# EAGLE board EEZ DIB MCU r1B1 (EAGLE 9.1.0), part 1 of 2
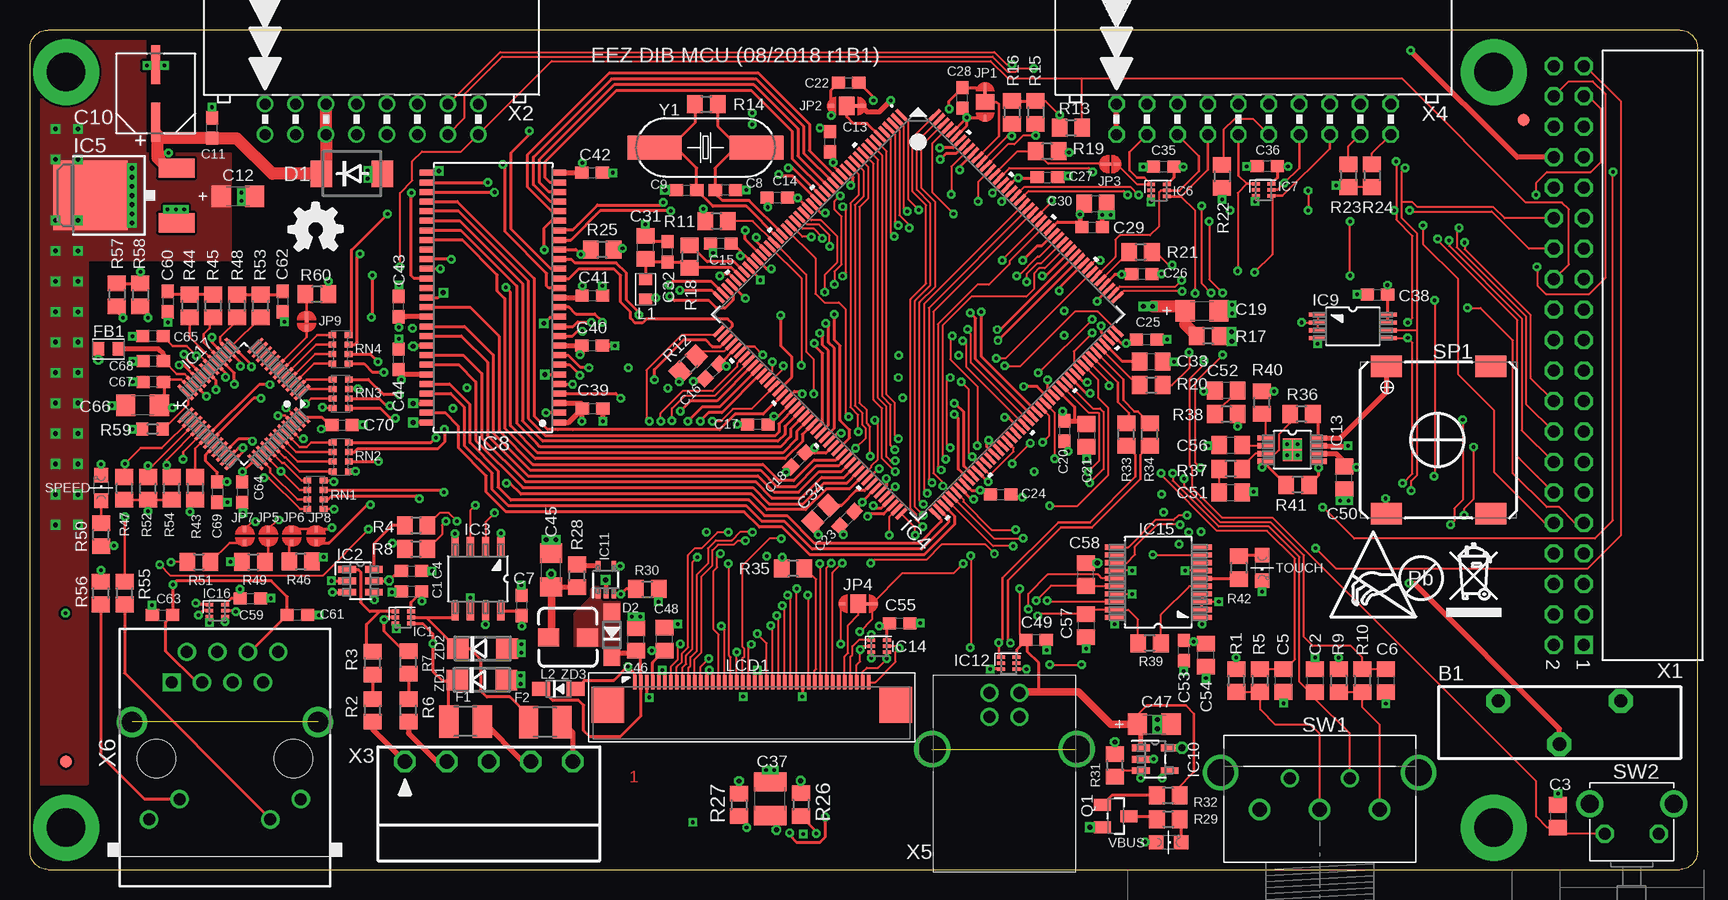
[diagram p5: board, top side]
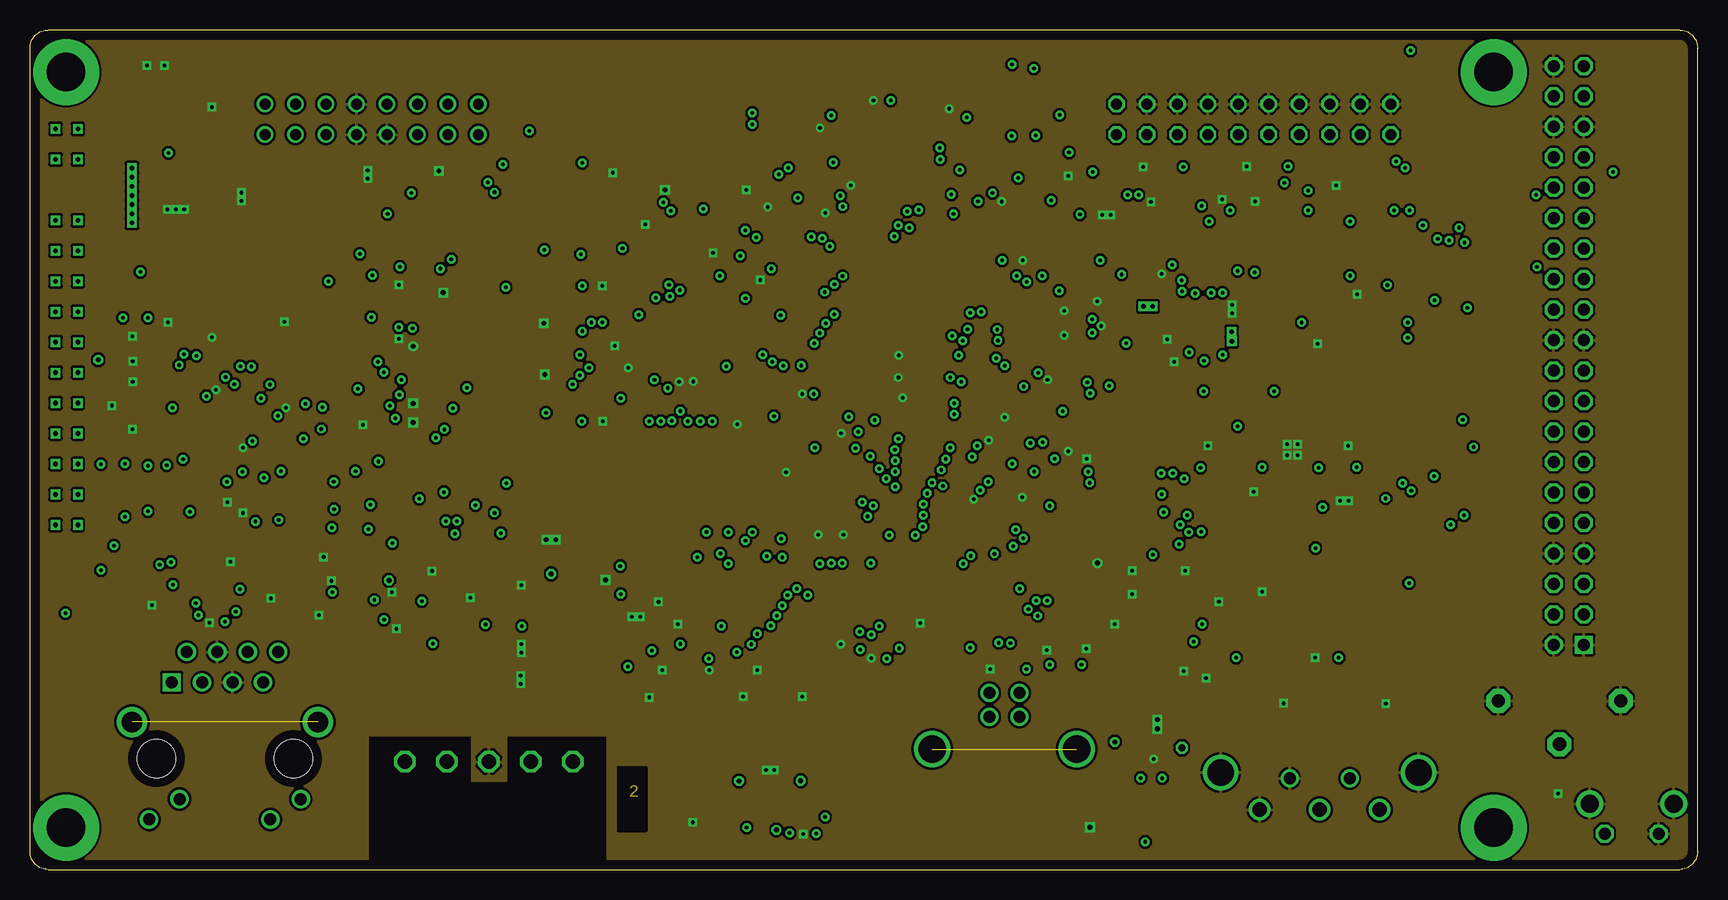
[diagram p6: board, inner layer Gnd]
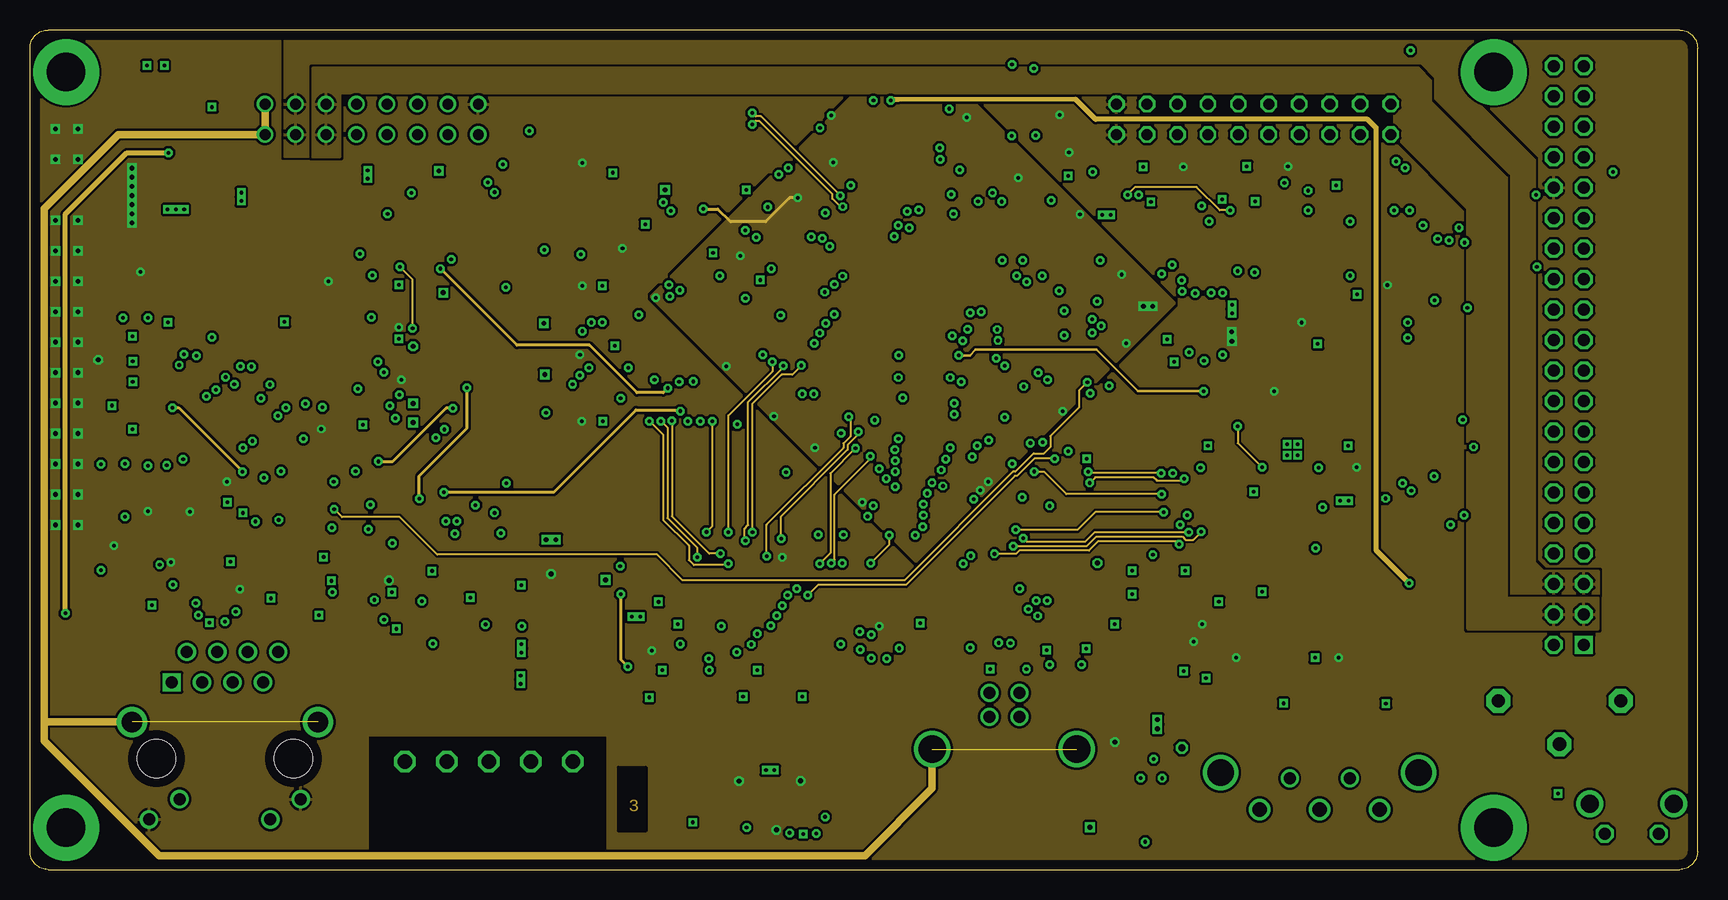
[diagram p7: board, inner layer Power]
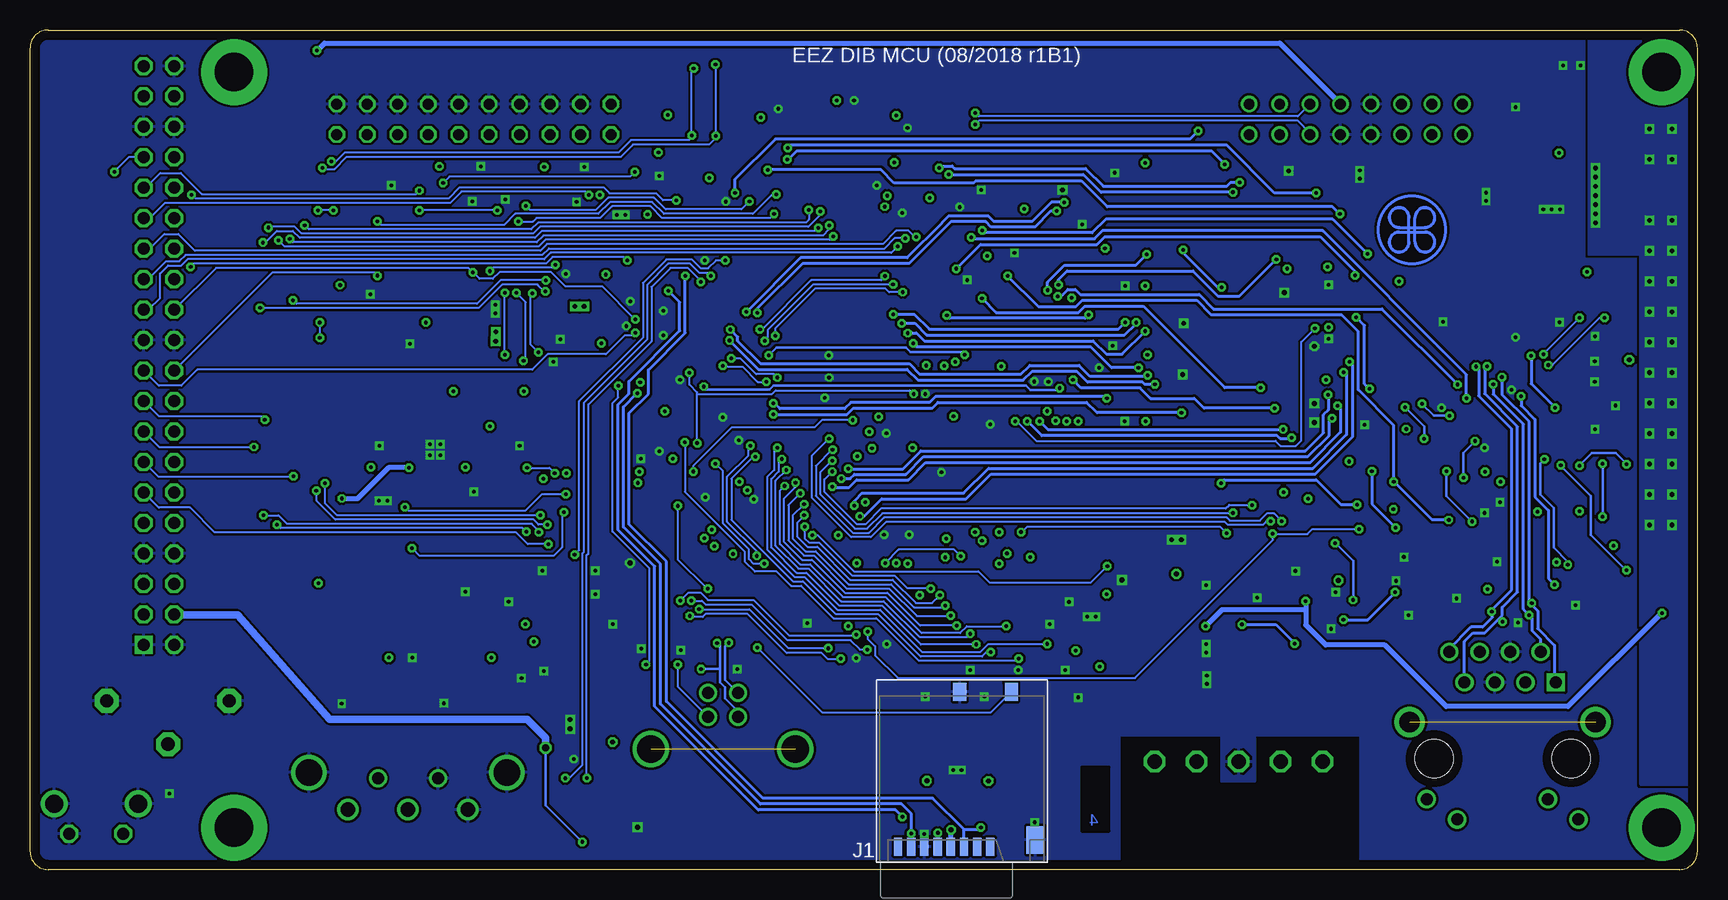
[diagram p8: board, bottom side, seen from below]

Size 139 x 70 mm. Coordinates in mm from the lower left corner, seen from the top.
Outline: 1.5,0 137.5,0 arc90 139,1.5 139,68.5 arc90 137.5,70 1.5,70 arc90 0,68.5 0,1.5 arc90 1.5,0
Copper layers (1+2+15+16): Top 0.035559375mm / dielectric 7mil / Gnd 0.03048125mm / dielectric 44mil / Power 0.03048125mm / dielectric 7mil / Bottom 0.035559375mm
Design rules "default *": minimum track width 6mil, minimum drill 0.3mm, track to track 4mil, track to pad 4mil, pad to pad 4mil, via to via 4mil, smd to smd 4mil, copper to edge 30mil, drill to drill 8mil, minimum pad ring 4mil, minimum via ring 8mil, stop-mask expansion 2.5mil, vias tented up to drill 0.6mm, thermal gap 8mil
Net classes: 0 default: width 0.152 mm, drill 0.3 mm, clearance 0.203 mm; 1 diff: width 0.229 mm, drill 0.3 mm, clearance 0.203 mm; 2 gnd: width 0.152 mm, drill 0.3 mm, clearance 0.203 mm

## Footprints (pad centres in the part's own frame; a part is rotated, then mirrored left to right if it is on the bottom)
DS1092-16-B6P = drill 1.1 pad 2 octagon: 1 -5.1,1.8; 2 0,-1.8; 3 5.1,1.8
C0603 = smd 1.1 x 1: 1 -0.85,0; 2 0.85,0
C0805 = smd 1.3 x 1.5: 1 -0.95,0; 2 0.95,0
CAPAE660X610N = smd 3.251 x 0.762: 1 -2.413,0; 2 2.413,0
EC1206 = smd 1.6 x 1.8: + -1.4,0; - 1.4,0
C1210 = smd 1.6 x 2.7: 1 -1.4,0; 2 1.4,0
C1206 = smd 1.6 x 1.8: 1 -1.4,0; 2 1.4,0
DO214AA = smd 1.8 x 2.2: A 2.55,0; C -2.55,0
SOD123 = smd 1.4 x 1.4: A 1.9,0; C -1.9,0
F1210 = smd 1.6 x 2.7: 1 -1.4,0; 2 1.4,0
BEAD0603 = smd 1 x 1.1: P$1 -0.85,0; P$2 0.85,0
FIDUCIAL = smd 1.016 x 1.016: T 0,0
DRL6 = smd 0.654 x 0.301: 1 -0.65,0.5; 2 -0.65,0; 3 -0.65,-0.5; 4 0.65,-0.5; 5 0.65,0; 6 0.65,0.5
DBV6 = smd 1.473 x 0.559: 1 -1.118,0.95; 2 -1.118,0; 3 -1.118,-0.95; 4 1.118,-0.95; 5 1.118,0; 6 1.118,0.95
SOIC127P600X173-8N = smd 1.55 x 0.6: 1 -2.7,1.9; 2 -2.7,0.63; 3 -2.7,-0.64; 4 -2.7,-1.91; 5 2.7,-1.91; 6 2.7,-0.64; 7 2.7,0.63; 8 2.7,1.9
LQFP-176_24X24MM = smd 1.2 x 0.3: 1 -12.75,10.75; 2 -12.75,10.25; 3 -12.75,9.75; 4 -12.75,9.25; 5 -12.75,8.75; 6 -12.75,8.25; 7 -12.75,7.75; 8 -12.75,7.25; 9 -12.75,6.75; 10 -12.75,6.25; 11 -12.75,5.75; 12 -12.75,5.25; 13 -12.75,4.75; 14 -12.75,4.25; 15 -12.75,3.75; 16 -12.75,3.25; 17 -12.75,2.75; 18 -12.75,2.25; 19 -12.75,1.75; 20 -12.75,1.25; 21 -12.75,0.75; 22 -12.75,0.25; 23 -12.75,-0.25; 24 -12.75,-0.75; 25 -12.75,-1.25; 26 -12.75,-1.75; 27 -12.75,-2.25; 28 -12.75,-2.75; 29 -12.75,-3.25; 30 -12.75,-3.75; 31 -12.75,-4.25; 32 -12.75,-4.75; 33 -12.75,-5.25; 34 -12.75,-5.75; 35 -12.75,-6.25; 36 -12.75,-6.75; 37 -12.75,-7.25; 38 -12.75,-7.75; 39 -12.75,-8.25; 40 -12.75,-8.75; 41 -12.75,-9.25; 42 -12.75,-9.75; 43 -12.75,-10.25; 44 -12.75,-10.75; 89 12.75,-10.75; 90 12.75,-10.25; 91 12.75,-9.75; 92 12.75,-9.25; 93 12.75,-8.75; 94 12.75,-8.25; 95 12.75,-7.75; 96 12.75,-7.25; 97 12.75,-6.75; 98 12.75,-6.25; 99 12.75,-5.75; 100 12.75,-5.25; 101 12.75,-4.75; 102 12.75,-4.25; 103 12.75,-3.75; 104 12.75,-3.25; 105 12.75,-2.75; 106 12.75,-2.25; 107 12.75,-1.75; 108 12.75,-1.25; 109 12.75,-0.75; 110 12.75,-0.25; 111 12.75,0.25; 112 12.75,0.75; 113 12.75,1.25; 114 12.75,1.75; 115 12.75,2.25; 116 12.75,2.75; 117 12.75,3.25; 118 12.75,3.75; 119 12.75,4.25; 120 12.75,4.75; 121 12.75,5.25; 122 12.75,5.75; 123 12.75,6.25; 124 12.75,6.75; 125 12.75,7.25; 126 12.75,7.75; 127 12.75,8.25; 128 12.75,8.75; 129 12.75,9.25; 130 12.75,9.75; 131 12.75,10.25; 132 12.75,10.75 | smd 0.3 x 1.2: 45 -10.75,-12.75; 46 -10.25,-12.75; 47 -9.75,-12.75; 48 -9.25,-12.75; 49 -8.75,-12.75; 50 -8.25,-12.75; 51 -7.75,-12.75; 52 -7.25,-12.75; 53 -6.75,-12.75; 54 -6.25,-12.75; 55 -5.75,-12.75; 56 -5.25,-12.75; 57 -4.75,-12.75; 58 -4.25,-12.75; 59 -3.75,-12.75; 60 -3.25,-12.75; 61 -2.75,-12.75; 62 -2.25,-12.75; 63 -1.75,-12.75; 64 -1.25,-12.75; 65 -0.75,-12.75; 66 -0.25,-12.75; 67 0.25,-12.75; 68 0.75,-12.75; 69 1.25,-12.75; 70 1.75,-12.75; 71 2.25,-12.75; 72 2.75,-12.75; 73 3.25,-12.75; 74 3.75,-12.75; 75 4.25,-12.75; 76 4.75,-12.75; 77 5.25,-12.75; 78 5.75,-12.75; 79 6.25,-12.75; 80 6.75,-12.75; 81 7.25,-12.75; 82 7.75,-12.75; 83 8.25,-12.75; 84 8.75,-12.75; 85 9.25,-12.75; 86 9.75,-12.75; 87 10.25,-12.75; 88 10.75,-12.75; 133 10.75,12.75; 134 10.25,12.75; 135 9.75,12.75; 136 9.25,12.75; 137 8.75,12.75; 138 8.25,12.75; 139 7.75,12.75; 140 7.25,12.75; 141 6.75,12.75; 142 6.25,12.75; 143 5.75,12.75; 144 5.25,12.75; 145 4.75,12.75; 146 4.25,12.75; 147 3.75,12.75; 148 3.25,12.75; 149 2.75,12.75; 150 2.25,12.75; 151 1.75,12.75; 152 1.25,12.75; 153 0.75,12.75; 154 0.25,12.75; 155 -0.25,12.75; 156 -0.75,12.75; 157 -1.25,12.75; 158 -1.75,12.75; 159 -2.25,12.75; 160 -2.75,12.75; 161 -3.25,12.75; 162 -3.75,12.75; 163 -4.25,12.75; 164 -4.75,12.75; 165 -5.25,12.75; 166 -5.75,12.75; 167 -6.25,12.75; 168 -6.75,12.75; 169 -7.25,12.75; 170 -7.75,12.75; 171 -8.25,12.75; 172 -8.75,12.75; 173 -9.25,12.75; 174 -9.75,12.75; 175 -10.25,12.75; 176 -10.75,12.75
DPACK = smd 1.6 x 3: 1 -2.28,-4.8; 3 2.28,-4.8 | smd 5.8 x 6.2: 4 0,2.38
TSOPII-54 = smd 1.2 x 0.5: 1 -5.502,10.4; 2 -5.502,9.6; 3 -5.502,8.8; 4 -5.502,8; 5 -5.502,7.2; 6 -5.502,6.4; 7 -5.502,5.6; 8 -5.502,4.8; 9 -5.502,4; 10 -5.502,3.2; 11 -5.502,2.4; 12 -5.502,1.6; 13 -5.502,0.8; 14 -5.502,0; 15 -5.502,-0.8; 16 -5.502,-1.6; 17 -5.502,-2.4; 18 -5.502,-3.2; 19 -5.502,-4; 20 -5.502,-4.8; 21 -5.502,-5.6; 22 -5.502,-6.4; 23 -5.502,-7.2; 24 -5.502,-8; 25 -5.502,-8.8; 26 -5.502,-9.6; 27 -5.502,-10.4; 28 5.502,-10.4; 29 5.502,-9.6; 30 5.502,-8.8; 31 5.502,-8; 32 5.502,-7.2; 33 5.502,-6.4; 34 5.502,-5.6; 35 5.502,-4.8; 36 5.502,-4; 37 5.502,-3.2; 38 5.502,-2.4; 39 5.502,-1.6; 40 5.502,-0.8; 41 5.502,0; 42 5.502,0.8; 43 5.502,1.6; 44 5.502,2.4; 45 5.502,3.2; 46 5.502,4; 47 5.502,4.8; 48 5.502,5.6; 49 5.502,6.4; 50 5.502,7.2; 51 5.502,8; 52 5.502,8.8; 53 5.502,9.6; 54 5.502,10.4
PW8_TSSOP8 = smd 1.473 x 0.356: 1 -2.921,0.975; 2 -2.921,0.325; 3 -2.921,-0.325; 4 -2.921,-0.975; 5 2.921,-0.975; 6 2.921,-0.325; 7 2.921,0.325; 8 2.921,0.975
DBV5 = smd 1.473 x 0.559: 1 -1.194,0.95; 2 -1.194,0; 3 -1.194,-0.95; 4 1.194,-0.95; 5 1.194,0.95
DCK5 = smd 0.85 x 0.4: 1 -1.125,0.65; 2 -1.125,0; 3 -1.125,-0.65; 4 1.125,-0.65; 5 1.125,0.65
SOP65P490X110-9N = smd 1.422 x 0.432: 1 -2.184,0.965; 2 -2.184,0.33; 3 -2.184,-0.33; 4 -2.184,-0.965; 5 2.184,-0.965; 6 2.184,-0.33; 7 2.184,0.33; 8 2.184,0.965 | smd 1.575 x 1.88: TP 0,0
SOP65P780X200-20N = smd 1.651 x 0.432: 1 -3.632,2.921; 2 -3.632,2.286; 3 -3.632,1.626; 4 -3.632,0.965; 5 -3.632,0.33; 6 -3.632,-0.33; 7 -3.632,-0.965; 8 -3.632,-1.626; 9 -3.632,-2.286; 10 -3.632,-2.921; 11 3.632,-2.921; 12 3.632,-2.286; 13 3.632,-1.626; 14 3.632,-0.965; 15 3.632,-0.33; 16 3.632,0.33; 17 3.632,0.965; 18 3.632,1.626; 19 3.632,2.286; 20 3.632,2.921
PT48 = smd 1.676 x 0.279: 1 -4.115,2.75; 2 -4.115,2.25; 3 -4.115,1.75; 4 -4.115,1.25; 5 -4.115,0.75; 6 -4.115,0.25; 7 -4.115,-0.25; 8 -4.115,-0.75; 9 -4.115,-1.25; 10 -4.115,-1.75; 11 -4.115,-2.25; 12 -4.115,-2.75; 25 4.115,-2.75; 26 4.115,-2.25; 27 4.115,-1.75; 28 4.115,-1.25; 29 4.115,-0.75; 30 4.115,-0.25; 31 4.115,0.25; 32 4.115,0.75; 33 4.115,1.25; 34 4.115,1.75; 35 4.115,2.25; 36 4.115,2.75 | smd 0.279 x 1.676: 13 -2.75,-4.115; 14 -2.25,-4.115; 15 -1.75,-4.115; 16 -1.25,-4.115; 17 -0.75,-4.115; 18 -0.25,-4.115; 19 0.25,-4.115; 20 0.75,-4.115; 21 1.25,-4.115; 22 1.75,-4.115; 23 2.25,-4.115; 24 2.75,-4.115; 37 2.75,4.115; 38 2.25,4.115; 39 1.75,4.115; 40 1.25,4.115; 41 0.75,4.115; 42 0.25,4.115; 43 -0.25,4.115; 44 -0.75,4.115; 45 -1.25,4.115; 46 -1.75,4.115; 47 -2.25,4.115; 48 -2.75,4.115
5033981892 = smd 0.7 x 1.5: 1 4.45,12.6; 2 5.55,12.6; 3 6.65,12.6; 4 7.75,12.6; 5 8.85,12.6; 6 9.95,12.6; 7 11.05,12.6; 8 12.15,12.6 | smd 1.45 x 2.33: S 0.7,12.04 | smd 1.1 x 1.5: SW1 2.7,-0.3; SW2 7,-0.3
JP3-CUT = smd 1.27 x 1.524: COM 0,0 | smd 0.889 x 0.254: NC -1.143,0 | smd 0.508 x 0.254: NO 1.333,0
JP2-NOCUT = smd 0.889 x 0.254: 1 -0.381,0 | smd 0.508 x 0.254: 2 0.572,0
JP2-CUT = smd 0.508 x 0.254: 1 -0.572,0; 2 0.572,0
DE0403 = smd 1.5 x 1.75: 1 0,1.626; 2 0,-1.625
FPC_40 = smd 0.3 x 1.2: 1 -9.75,1.9; 2 -9.25,1.9; 3 -8.75,1.9; 4 -8.25,1.9; 5 -7.75,1.9; 6 -7.25,1.9; 7 -6.75,1.9; 8 -6.25,1.9; 9 -5.75,1.9; 10 -5.25,1.9; 11 -4.75,1.9; 12 -4.25,1.9; 13 -3.75,1.9; 14 -3.25,1.9; 15 -2.75,1.9; 16 -2.25,1.9; 17 -1.75,1.9; 18 -1.25,1.9; 19 -0.75,1.9; 20 -0.25,1.9; 21 0.25,1.9; 22 0.75,1.9; 23 1.25,1.9; 24 1.75,1.9; 25 2.25,1.9; 26 2.75,1.9; 27 3.25,1.9; 28 3.75,1.9; 29 4.25,1.9; 30 4.75,1.9; 31 5.25,1.9; 32 5.75,1.9; 33 6.25,1.9; 34 6.75,1.9; 35 7.25,1.9; 36 7.75,1.9; 37 8.25,1.9; 38 8.75,1.9; 39 9.25,1.9; 40 9.75,1.9 | smd 2.7 x 3: Z1 -12,0; Z2 12,0
SOT23-BEC = smd 1 x 1.4: B -0.95,-1.1; C 0,1.1; E 0.95,-1.1
R0805 = smd 1.3 x 1.5: 1 -0.95,0; 2 0.95,0
R0603 = smd 1 x 1.1: 1 -0.85,0; 2 0.85,0
CAY16 = smd 0.5 x 0.65: 1 -1.2,-0.675; 2 -0.4,-0.675; 3 0.4,-0.675; 4 1.2,-0.675; 5 1.2,0.675; 6 0.4,0.675; 7 -0.4,0.675; 8 -1.2,0.675
LD-BZEL-M1313 = smd 1.8 x 2.6: + -6.15,-4.35; - 6.15,-4.35; NC1 -6.15,4.35; NC2 6.15,4.35
LED_0805 = smd 1.2 x 1.2: A 0,-1.05; C 0,1.05
PEC16-2215F = drill 1.2: A 0,5; B 0,0; C 0,-5 | drill 1: D -2.6,-2.5; E -2.6,2.5 | drill 2.2: GND1 -3.1,8.25; GND2 -3.1,-8.25
BSF-315X = drill 1 octagon: 1 -2.25,0; 2 2.25,0 | drill 1.5: 3 -3.5,2.5; 4 3.5,2.5
ZL263-40DG = drill 1 pad 1.5 square: 1 48.26,2.54 | drill 1 pad 1.5 octagon: 2 48.26,0; 3 45.72,2.54; 4 45.72,0; 5 43.18,2.54; 6 43.18,0; 7 40.64,2.54; 8 40.64,0; 9 38.1,2.54; 10 38.1,0; 11 35.56,2.54; 12 35.56,0; 13 33.02,2.54; 14 33.02,0; 15 30.48,2.54; 16 30.48,0; 17 27.94,2.54; 18 27.94,0; 19 25.4,2.54; 20 25.4,0; 21 22.86,2.54; 22 22.86,0; 23 20.32,2.54; 24 20.32,0; 25 17.78,2.54; 26 17.78,0; 27 15.24,2.54; 28 15.24,0; 29 12.7,2.54; 30 12.7,0; 31 10.16,2.54; 32 10.16,0; 33 7.62,2.54; 34 7.62,0; 35 5.08,2.54; 36 5.08,0; 37 2.54,2.54; 38 2.54,0; 39 0,2.54; 40 0,0
ML16L = drill 0.914: 1 -8.89,-1.27; 2 -8.89,1.27; 3 -6.35,-1.27; 4 -6.35,1.27; 5 -3.81,-1.27; 6 -3.81,1.27; 7 -1.27,-1.27; 8 -1.27,1.27; 9 1.27,-1.27; 10 1.27,1.27; 11 3.81,-1.27; 12 3.81,1.27; 13 6.35,-1.27; 14 6.35,1.27; 15 8.89,-1.27; 16 8.89,1.27
MC1,5/5-G-3,5 = drill 1.2 octagon: 1 -7,0; 2 -3.5,0; 3 0,0; 4 3.5,0; 5 7,0
ML20L = drill 0.914 octagon: 1 -11.43,-1.27; 2 -11.43,1.27; 3 -8.89,-1.27; 4 -8.89,1.27; 5 -6.35,-1.27; 6 -6.35,1.27; 7 -3.81,-1.27; 8 -3.81,1.27; 9 -1.27,-1.27; 10 -1.27,1.27; 11 1.27,-1.27; 12 1.27,1.27; 13 3.81,-1.27; 14 3.81,1.27; 15 6.35,-1.27; 16 6.35,1.27; 17 8.89,-1.27; 18 8.89,1.27; 19 11.43,-1.27; 20 11.43,1.27
USB-B = drill 1: 1 6.742,-1.377; 2 6.742,1.123; 3 4.742,1.123; 4 4.742,-1.377 | drill 2.3: M1 2.032,5.893; M2 2.032,-6.147
RJ45-TRAFO-LED = drill 1 pad 1.524 square: 1 -4.445,6.35 | drill 1 pad 1.524: 2 -3.175,8.89; 3 -1.905,6.35; 4 -0.635,8.89; 5 0.635,6.35; 6 1.905,8.89; 7 3.175,6.35; 8 4.445,8.89; 9 -6.325,-5.08; 10 -3.785,-3.38; 11 3.785,-5.08; 12 6.325,-3.38 | drill 1.7 pad 2.54: SH -7.75,3.05; SH2 7.75,3.05 | hole 3.2: -5.715,0; 5.715,0
HC-49/4H = smd 4.5 x 2: 1 -4.25,0; 2 4.25,0
DO214AC = smd 1.8 x 1.7: A 2.05,0; C -2.05,0
SOD323-W = smd 1.5 x 1.2: A 1.45,0; C -1.45,0

## Placement (x,y rotation side)
B1  DS1092-16-B6P  [DS1092-16-B6P]  127.5,12.26 0 top
C1  100n  [C0603]  31.8,23.18 180 top
C2  10n  [C0805]  107.12,15.75 270 top
C3  10n  [C0805]  127.37,4.45 270 top
C4  100n  [C0603]  31.8,24.89 0 top
C5  10n  [C0805]  104.49,15.76 90 top
C6  10n  [C0805]  113.02,15.75 270 top
C7  100n  [C0603]  40.96,22.01 270 top
C8  18p  [C0603]  57.97,56.64 180 top
C9  18p  [C0603]  54.73,56.64 0 top
C10  47u  [CAPAE660X610N]  10.47,64.71 90 top
C11  100n  [C0603]  15.17,61.82 90 top
C12  10u  [EC1206]  17.33,56.13 0 top
C13  100n  [C0603]  66.7,60.68 90 top
C14  100n  [C0603]  62.28,56.01 180 top
C15  100n  [C0603]  57.59,52.2 180 top
C16  100n  [C0603]  56.86,41.54 225 top
C17  100n  [C0603]  60.66,37.11 180 top
C18  100n  [C0603]  64.05,34.15 225 top
C19  4u7  [EC1206]  97.69,46.58 0 top
C20  100n  [C0603]  86.22,36.56 270 top
C21  1u  [C0805]  88.07,36.2 270 top
C22  N.C.  [C0603]  68.24,65.6 0 top
C23  100n  [C0603]  68.1,29.26 225 top
C24  100n  [C0603]  80.92,31.27 0 top
C25  100n  [C0603]  93.08,44.2 0 top
C26  100n  [C0603]  92.68,49.66 0 top
C27  100n  [C0603]  84.81,57.71 0 top
C28  100n  [C0603]  77.72,64.34 90 top
C29  100n  [C0603]  88.55,53.54 0 top
C30  1u  [C0805]  88.82,55.51 0 top
C31  1u  [C0805]  51.31,51.88 90 top
C32  100n  [C0603]  53.14,51.5 90 top
C33  2u2  [C0805]  93.46,42.35 0 top
C34  2u2  [C0805]  65.92,29.68 225 top
C35  100n  [C0603]  94.49,58.59 180 top
C36  100n  [C0603]  103.14,58.64 180 top
C37  10u  [C1210]  61.7,5.91 90 top
C38  100n  [C0603]  112.32,47.92 0 top
C39  100n  [C0603]  46.89,38.44 0 top
C40  100n  [C0603]  46.85,43.69 0 top
C41  100n  [C0603]  46.87,47.84 0 top
C42  100n  [C0603]  46.85,58.1 0 top
C43  100n  [C0603]  30.74,46.94 90 top
C44  100n  [C0603]  30.74,42.55 90 top
C45  4u7  [C1206]  43.44,24.97 90 top
C46  1u  [C0805]  50.52,19.19 90 top
C47  4u7/16V (293D475X9016A2TE3)  [EC1206]  93.72,12.12 0 top
C48  2u2  [C0805]  52.9,19.2 90 top
C49  100n  [C0603]  83.86,19.13 180 top
C50  1u  [C0805]  109.54,32.65 90 top
C51  470n  [C0805]  100.08,31.45 0 top
C52  470n  [C0805]  99.72,39.93 180 top
C53  100n  [C0603]  96.18,18.26 90 top
C54  1u  [C0805]  98.02,17.88 90 top
C55  100n  [C0603]  72.5,20.54 180 top
C56  220n  [C0805]  100.08,35.38 0 top
C57  10n  [C0805]  88.02,20.33 270 top
C58  10n  [C0805]  88,24.6 90 top
C59  100n  [C0603]  18.38,22.61 0 top
C60  100n  [C0603]  11.48,47.36 270 top
C61  100n  [C0603]  22.29,21.21 180 top
C62  100n  [C0603]  21.06,47.36 270 top
C63  100n  [C0603]  11.05,21.21 0 top
C64  100n  [C0603]  17.71,31.46 270 top
C65  100n  [C0603]  10.25,44.46 180 top
C66  10u  [EC1206]  9.39,38.7 180 top
C67  100n  [C0603]  10.28,40.67 180 top
C68  100n  [C0603]  10.28,42.38 180 top
C69  100n  [C0603]  15.61,31.47 270 top
C70  100n  [C0603]  26.01,37.06 0 top
D1  SMBJ5.0A-TR  [DO214AA]  26.84,58.01 0 top
D2  NSR0240  [SOD123]  48.49,19.57 90 top
EEZ_SIGNATURE  SIGNATURESMALL  [SIGNATURE_5MM]  23.8,53.34 180 top
F1  50mA  [F1210]  36.31,12.34 180 top
F2  50mA  [F1210]  42.96,12.29 180 top
FB1  60R@100MHz  [BEAD0603]  6.53,43.41 0 top
FM1  FIDUCIAL  [FIDUCIAL]  3,9 0 top
FM2  FIDUCIAL  [FIDUCIAL]  124.5,62.5 0 top
IC1  TPD4E001DRLR  [DRL6]  31.11,21.02 0 top
IC2  SN74LVC2G34DBVR  [DBV6]  27.55,24.07 0 top
IC3  BTS3408G  [SOIC127P600X173-8N]  37.34,24.24 270 top
IC4  STM32F769IGT6  [LQFP-176_24X24MM]  74.03,46.29 315 top
IC5  LD1117ADT33TR  [DPACK]  7.42,56.2 90 top
IC6  TPD4E001DRLR  [DRL6]  94.11,56.62 0 top
IC7  TPD4E001DRLR  [DRL6]  102.82,56.67 0 top
IC8  IS42S16400J  [TSOPII-54]  38.6,47.69 180 top
IC9  BR24G64FVT-3AGE2  [PW8_TSSOP8]  110.27,45.29 0 top
IC10  TPS2051BDBVR  [DBV5]  93.79,9.19 0 top
IC11  TPS61169DCKR  [DCK5]  48.01,24.17 90 top
IC12  TPD4E001DRLR  [DRL6]  81.59,17.21 0 top
IC13  TPA6205A1DGN  [SOP65P490X110-9N]  105.22,35 0 top
IC14  TPD4E001DRLR  [DRL6]  70.78,18.63 0 top
IC15  AR1021-I/SS  [SOP65P780X200-20N]  94.05,23.95 180 top
IC16  TPD4E001DRLR  [DRL6]  15.61,21.59 0 top
IC17  DP83848CVV/NOPB  [PT48]  17.84,38.82 225 top
J1  5033981892  [5033981892]  54.5,14.5 180 bottom
JP1  JP3-CUT  [JP3-CUT]  79.62,64 270 top
JP2  JP3-CUT  [JP3-CUT]  68.09,63.67 180 top
JP3  JP2-NOCUT  [JP2-NOCUT]  90.05,58.81 0 top
JP4  JP3-CUT  [JP3-CUT]  69.04,22.16 180 top
JP5  JP2-CUT  [JP2-CUT]  19.87,27.81 270 top
JP6  JP2-CUT  [JP2-CUT]  21.82,27.81 270 top
JP7  JP2-CUT  [JP2-CUT]  17.91,27.81 90 top
JP8  JP2-CUT  [JP2-CUT]  23.84,27.81 270 top
JP9  JP2-NOCUT  [JP2-NOCUT]  23.05,45.69 270 top
L1  LCBA-600  [BEAD0603]  51.31,48.37 90 top
L2  DLG-0403-4R7  [DE0403]  44.84,19.37 90 top
LCD1  PCA-6-LA-40-HL-3  [FPC_40]  60.16,13.72 0 top
Q1  MMBT5551  [SOT23-BEC]  90.5,4.46 270 top
R1  4K7  [R0805]  100.55,15.76 270 top
R2  4K7  [R0805]  28.57,13.27 90 top
R3  4K7  [R0805]  28.57,17.21 90 top
R4  1K  [R0805]  32.19,28.7 0 top
R5  10K  [R0805]  102.52,15.76 270 top
R6  4K7  [R0805]  31.55,13.27 90 top
R7  4K7  [R0805]  31.55,17.27 90 top
R8  1K  [R0805]  32.19,26.73 0 top
R9  4K7  [R0805]  109.08,15.75 270 top
R10  10K  [R0805]  111.05,15.75 270 top
R11  10K  [R0805]  57.23,54.08 0 top
R12  10K  [R0805]  54.87,42.15 45 top
R13  4K7  [R0805]  86.77,61.86 0 top
R14  1M  [R0805]  56.38,63.82 0 top
R15  4K7  [R0805]  83.82,63.12 270 top
R16  4K7  [R0805]  81.86,63.12 270 top
R17  0R  [R0805]  98.2,44.49 180 top
R18  47R  [R0805]  55,51.1 270 top
R19  47K  [R0805]  84.79,59.88 180 top
R20  22R  [R0805]  93.46,40.39 0 top
R21  22R  [R0805]  92.57,51.5 0 top
R22  10K  [R0805]  99.37,57.78 270 top
R23  10K  [R0805]  109.9,57.85 270 top
R24  10K  [R0805]  111.87,57.85 270 top
R25  10K  [R0805]  47.69,51.69 180 top
R26  47K  [R0805]  64.27,5.41 270 top
R27  47K  [R0805]  59.1,5.4 270 top
R28  10R  [R0805]  45.61,24.49 90 top
R29  47K  [R0805]  94.89,4.2 0 top
R30  10R  [R0805]  51.45,23.38 0 top
R31  47K  [R0805]  90.43,8.69 90 top
R32  47K  [R0805]  94.89,6.17 180 top
R33  22R  [R0805]  91.38,36.27 90 top
R34  22R  [R0805]  93.34,36.27 90 top
R35  10K  [R0805]  63.61,25.11 180 top
R36  20K  [R0805]  105.99,37.99 180 top
R37  10K  [R0805]  100.08,33.41 180 top
R38  10K  [R0805]  99.72,37.96 180 top
R39  20K  [R0805]  93.32,18.87 180 top
R40  47K  [R0805]  102.68,38.94 90 top
R41  20K  [R0805]  105.67,32.08 180 top
R42  4K7  [R0805]  100.75,25.16 270 top
R43  1K5  [R0805]  13.77,31.78 270 top
R44  49R9  [R0805]  13.33,46.99 270 top
R45  49R9  [R0805]  15.28,46.99 90 top
R46  2K2  [R0805]  22.56,25.67 180 top
R47  2K2  [R0805]  7.87,31.78 90 top
R48  49R9  [R0805]  17.25,46.99 270 top
R49  2K2  [R0805]  18.62,25.65 0 top
R50  220R  [R0805]  5.92,27.91 90 top
R51  2K2  [R0805]  14.08,25.64 0 top
R52  2K2  [R0805]  9.83,31.78 90 top
R53  49R9  [R0805]  19.22,46.99 90 top
R54  2K2  [R0805]  11.8,31.78 90 top
R55  220R  [R0805]  7.89,23.05 90 top
R56  220R  [R0805]  5.91,23.05 90 top
R57  2K2  [R0805]  7.24,47.92 270 top
R58  2K2  [R0805]  9.2,47.92 270 top
R59  4K87  [R0603]  10.21,36.73 0 top
R60  2K2  [R0805]  23.92,47.97 180 top
RN1  DR1206-33R-4/8  [CAY16]  23.8,31.24 90 top
RN2  DR1206-33R-4/8  [CAY16]  25.91,34.4 90 top
RN3  DR1206-33R-4/8  [CAY16]  25.91,39.67 90 top
RN4  DR1206-33R-4/8  [CAY16]  25.89,43.38 90 top
SP1  LD-BZEL-M1313  [LD-BZEL-M1313]  117.42,35.8 270 top
SPEED  HSMY-C170  [LED_0805]  5.94,31.81 0 top
SW1  PEC16-2215F-S0024  [PEC16-2215F]  107.5,5 270 top
SW2  BSF-3152  [BSF-315X]  133.5,3 0 top
TOUCH  HSMY-C170  [LED_0805]  102.71,25.15 180 top
U$1  [RECYCLE_BIN1/8]  118.05,21.06 0 top
U$5  [PB_SMALL]  115.95,24.29 180 top
U$6  [ESD_SYMBOL]  108.41,21.06 0 top
VBUS  HSMG-C170  [LED_0805]  94.91,2.27 270 top
X1  ZL263-40DG  [ZL263-40DG]  127,67 270 top
X2  ZL231-16KG  [ML16L]  28.48,62.56 0 top
X3  1844249  [MC1,5/5-G-3,5]  38.25,9 0 top
X4  ZL231-20KG  [ML20L]  102,62.56 0 top
X5  292304-1  [USB-B]  81.1,8 90 top
X6  LMJTAB881243M-L  [RJ45-TRAFO-LED]  16.25,9.25 0 top
Y1  10MHz  [HC-49/4H]  56.32,60.2 0 top
ZD1  SMAJ18A  [DO214AC]  37.66,15.8 0 top
ZD2  SMAJ18A  [DO214AC]  37.72,18.4 0 top
ZD3  BZX384-B30.115  [SOD323-W]  44.05,15.06 0 top

## Tracks (layer width: path | path; a pad name or v marks a point on that pad's centre or on a via)
!AUDIO_SHDN
  Top 0.152: IC13.1 103.04,37.63 R40.1
!FAULT  (via drill 0.3)
  Top 0.152: IC4.58 60.13,38.41 58.6,38.41 57.59,37.39 v56.86,37.39 | 87.7,65.97 81.51,65.97 80.08,67.4 43.48,67.4 X2.15 35.95,59.87 32.68,59.87 31.87,59.05 31.87,57.44 30.84,56.41 v30.84,50.24 | 87.7,65.97 114.34,65.97 124.69,55.61 127.7,55.61 128.27,55.04 128.27,50.46 127.04,49.22 X1.26 | R13.2 87.7,61.88 87.7,65.97
  Top 0.254: v39.25,28.04 IC3.1
  Power 0.152: v56.86,37.39 56.86,28.61 v56.39,28.14 | v30.84,50.24 31.89,49.19 v31.89,45.12
  Bottom 0.152: v56.39,28.14 56.32,28.14 55.87,28.59 39.79,28.59 v39.25,28.04 | v56.86,37.39 56.76,37.39 55.11,35.74 35.18,35.74 34.76,35.32 33.48,35.32 33.04,35.76 33.04,43.98 v31.89,45.12
!RESET  (via drill 0.3)
  Top 0.152: R11.2 60.24,54.08 IC4.31 64.7,49.62 64.7,43.18 65.35,42.53 v65.35,39.65 | v28.22,28.38 28.22,28.35 24.38,24.5 11.74,24.5 v10.81,25.43 | v81.87,33.83 81.87,34.04 v83.39,35.56 | v88.55,45.87 84.1,41.43 v84.04,41.43 | IC7.4 103.56,56.08 103.56,51.28 v102.07,49.8 | v69.17,19.82 70.18,20.84 JP4.NC 72.75,24.73 77.02,24.73 v77.78,25.49 | IC3.4 35.44,27.98 v35.41,28
  Top 0.203: IC17.29 12.77,34.82 v12.77,34.2 | IC7.4 104.41,56.17 108.35,60.1 X4.15
  Top 0.254: IC3.4
  Bottom 0.152: v28.22,28.38 32.1,28.38 32.5,27.98 35.39,27.98 | v65.35,39.65 65.65,39.95 76.85,39.95 77.18,39.62 83.37,39.62 83.39,39.6 | v83.39,35.56 83.39,39.6 | 83.39,39.6 83.39,39.79 84.03,40.42 84.03,41.41 v84.04,41.43 | X1.24 123.5,50.16 102.44,50.16 v102.07,49.8 101.53,49.25 100.42,49.25 99.86,49.81 95.56,49.81 94.39,48.64 91.32,48.64 v88.55,45.87 | v69.17,19.82 69.17,19.21 68.56,18.61 68.56,17.87 66.67,15.98 46.89,15.98 35.39,27.48 35.39,27.98 | 35.39,27.98 v35.41,28 | v77.78,25.49 78.68,25.49 79.07,25.88 79.07,26.68 81.25,28.85 81.25,33.21 v81.87,33.83
  Bottom 0.203: v12.77,34.2 13.11,33.86 13.11,31.25 11.99,30.14 11.99,26.84 10.81,25.65 v10.81,25.43
!USB_OTG_FS_OC  (via drill 0.3)
  Top 0.152: v83.08,48.98 83.08,49.64 83.98,50.55 84.29,50.55 IC4.146 | v92.59,7.63 92.59,8.23 IC10.3 90.94,8.24 R31.1
  Bottom 0.152: v83.08,48.98 83.08,49.07 84.15,50.15 85.61,50.15 87.19,48.58 87.19,44.03 92.45,38.77 92.45,26.35 92.59,26.21 v92.59,7.63
+3V3  (via drill 0.3, 0.4)
  Top 0.152: R1.1 v100.55,17.67 | R9.1 v109.08,17.65 | C35.1 v96.14,58.59 | v104.86,58.64 C36.1 | R13.1 v85.82,62.92 84.67,64.07 R15.1 | R51.1 v11.74,25.64 | R40.2 v103.7,39.89 | v106.01,45.61 IC9.2 | IC9.1 IC9.2 | IC9.3 IC9.2 | 71.43,20.41 70.92,20.41 v70.81,20.3 | R35.2 62.66,25.97 v62.7,26.02 | C44.1 30.94,41.7 30.95,41.68 | R50.1 5.95,26.99
  Top 0.203: R47.1 R52.1 | R52.1 R54.1 | R52.1 v9.83,29.87 | 5.95,26.99 v6.99,26.99 | R58.1 v9.2,49.82 | v5.68,42.49 FB1.P$1 | v24.88,49.03 24.89,47.99 R60.1
  Top 0.229: R26.1 64.27,7.37 v64.24,7.39
  Top 0.254: R57.1 R58.1 | C35.1 95.34,57.7 IC6.6 | C36.1 103.99,57.69 IC7.6 | v49.4,51.78 R25.1 | IC14.6 71.43,20.32 C55.2 71.43,20.32 71.43,20.41 | IC9.7 IC9.8 113.19,47.52 C38.2 113.15,47.56 v113.15,48.73 | IC17.32 14.66,34.59 14.66,34.06 15.61,33.11 C69.1 v16.41,32.32 | v30.75,45.21 30.75,46.08 C43.1 | v17.51,23.38 17.51,22.54 C59.1 16.78,22.61 IC16.6 | v13.33,29.83 13.33,30.38 R43.2 | v24.27,36.73 24.83,36.73 C70.1 24.97,37.06 24.34,37.69 22.85,37.69 IC17.48 | IC2.5 29.89,24.07 v29.93,24.11 30.71,24.89 C4.1 | LCD1.4 51.91,17.26 C48.1 v51.85,18.25 | 45.87,47.69 C41.1 | R16.1 R15.1 | v97.69,20.47 97.69,21.02 IC15.1 | C54.2 97.86,19 v97.01,19 96.3,19 C53.2 | v86.61,59.78 85.84,59.78 R19.1 | v110.58,33.54 109.6,33.54 C50.2
  Top 0.406: IC8.3 45.98,38.89 C39.1 | v46.03,48.67 46.03,47.71 C41.1 | v45.85,42.93 46.01,42.95 C40.1 IC8.9 | v46.03,58.93 46.01,58.9 C42.1 45.99,58.09 IC8.27 | IC8.43 31.33,46.09 C43.1 | IC8.49 31.16,41.29 C44.1 | 30.95,41.68 v30.95,40.82 | v59.1,7.38 R27.1 | C37.1 62.22,3.98 v62.22,3.3 | X4.1 X4.2 | IC8.14 45.87,47.69 | v100.17,44.83 99.49,44.83 R17.1 | v46.02,37.38 46.02,38.42 C39.1 | IC8.1 44.89,37.29 C39.1 | v90.43,10.63 R31.2 | IC13.6 108.86,34.67 109.54,33.98 C50.2 | R28.1 43.47,23.54 C45.1 v43.44,24.65
  Top 0.61: 43.47,23.54 43.47,19.63 L2.1
  Bottom 0.406: J1.4 62.25,3.27 v62.22,3.3
  other vias: 100.18,44.04 8.5,56.2 8.5,56.96 8.5,57.72 8.5,55.44 8.5,54.67 8.5,53.91 8.5,58.48 2.13,51.59 2.13,49.05 2.13,46.51 2.13,43.97 2.13,41.43 2.13,38.89 3.99,51.59 3.99,49.05 3.99,46.51 3.99,43.97 3.99,41.43 3.99,38.89 3.99,36.35 3.99,33.81 2.13,36.35 2.13,33.81 3.99,31.27 3.99,28.73 2.13,31.27 2.13,28.73 2.13,54.13 3.99,54.13 3.99,59.21 3.99,61.75 2.13,59.21 2.13,61.75
  pour Power (isolate 0.203, rank 4): -0.07,69.34 139.12,69.85 139.12,0.76 48.19,0.76 48.19,11.18 28.12,11.18 28.12,0.25 -0.07,0.25
  pour Top (isolate 0.203, no thermals): -0.33,70.1 9.58,70.1 9.58,59.69 16.69,59.69 16.69,50.8 4.75,50.8 4.75,7.11 -0.33,7.11
  pour Bottom (isolate 0.203, no thermals): -0.33,70.1 9.07,70.1 9.07,51.31 4.75,51.31 4.75,7.11 -0.33,7.11
+3V3(A)  (via drill 0.3)
  Top 0.203: IC17.22 12.88,41.3 12.25,41.3 11.17,42.38
  Top 0.254: 11.17,42.38 C68.1 | v14.7,39.47 14.7,39.49 IC17.22 | X6.3 13.93,15.6 11.33,18.2 11.33,20.64 C63.2 v11.9,23.76 12.22,24.08 20.11,24.08 21.44,22.75 C61.2 18.37,18.14 X6.6
  Top 0.406: C68.1 11.13,42.97 10.7,43.4 8.37,43.4 FB1.P$2
  Bottom 0.254: v14.7,39.47 14.7,38.68 13.55,37.54 13.55,31.08 12.43,29.95 12.43,24.28 v11.9,23.76
+5V  (via drill 0.3, 0.6)
  Top 0.152: C7.2 40.96,20.33 v41,20.3
  Top 0.254: C10.1 10.47,61.4 10.6,61.28 | IC1.6 31.76,22.28 C1.1 | IC3.8 40.58,21.54 C7.2 | VBUS.A 93.01,2.27 v92.97,2.31
  Top 0.406: C1.1 v32.66,22.39 | v11.55,59.77 11.29,59.77 10.75,59.22 | IC10.5 v96.01,10.14 v96.02,10.15
  Top 1.016: 10.6,61.28 10.62,61.25 10.62,61.23 | 10.62,61.23 10.62,59.35 10.75,59.22 11.48,58.48 IC5.3 | X2.6 X2.5 24.67,58.4 D1.C 20.21,58.01 17.25,60.97 C11.1 10.87,60.97 10.62,61.23
  Power 0.406: v2.95,21.37 2.95,54.65 8.07,59.77 v11.55,59.77
  Bottom 0.203: v96.02,10.15 96.02,5.36 v92.97,2.31
  Bottom 0.406: v2.95,21.37 3.01,21.37 10.8,13.59 20.95,13.59 26.08,18.72 30.98,18.72 32.66,20.39 32.66,21.67 | v32.66,22.39 32.66,21.67 | 32.66,21.67 32.67,21.65 39.64,21.65 v41,20.3
  Bottom 0.61: X1.4 126.91,21.21 121.7,21.21 114.04,12.54 97.57,12.54 96.02,10.99 v96.02,10.15
  pour Power (isolate 0.203): 23.55,59.44 25.84,59.44 25.84,64.77 113.72,64.77 113.72,61.21 119.82,55.12 119.82,20.07 130.74,20.07 130.74,22.61 123.12,22.61 123.12,57.66 116.77,64.01 116.77,65.79 115.75,66.8 23.55,66.8
+12V
  pour Power (isolate 0.203, rank 2): 23.55,59.44 21.26,59.44 21.26,70.1 120.83,70.1 120.83,63.75 125.4,59.18 125.4,25.65 126.17,24.89 130.74,24.89 130.74,22.61 123.12,22.61 123.12,57.66 116.77,64.01 116.77,65.79 115.5,67.06 23.55,67.06
+VAUX  (via drill 0.3)
  Top 0.406: X1.34 123.97,59.38 v115.08,68.28
  Bottom 0.406: X2.10 34.83,68.91 114.44,68.91 v115.08,68.28
BOOT0
  Top 0.203: JP1.COM 80.57,63.99 80.75,63.82 80.75,61.14 IC4.166
BYPASS_REG
  Top 0.152: IC4.48 57.85,43.19 55.91,43.19 R12.2
DAC_OUT1  (via drill 0.3)
  Top 0.152: v97.83,39.88 98.72,39.88 C52.2
  Top 0.203: IC4.50 59.67,43.6 60.39,43.6 v61.08,42.91
  Power 0.203: v77.42,42.86 78.34,42.86 78.82,43.34 88.89,43.34 92.35,39.89 v97.82,39.89 v97.83,39.88
  Bottom 0.203: v61.08,42.91 61.31,43.14 65.59,43.14 65.97,43.52 76.76,43.52 v77.42,42.86
DBGACK
  Top 0.152: R24.1 111.87,59.73 X4.19
DBGRQ
  Top 0.152: R23.1 109.9,60.3 X4.17
DIN1  (via drill 0.3)
  Top 0.152: v35.59,29.03 35.59,29.05 34.9,29.73 34.16,29.73 R4.2 | v72.39,35.93 v72.38,35.93 72.1,36.21 72.1,38.9 71.4,39.6 71.4,59.88 IC4.7
  Bottom 0.152: v35.59,29.03 35.96,29.03 36.25,28.74 39.15,28.74 39.4,28.99 67.64,28.99 68.91,27.72 70.55,27.72 73.84,31.01 73.84,34.48 v72.39,35.93
DIN2  (via drill 0.3)
  Top 0.152: v34.67,29.06 34.34,28.73 34.34,27.94 R8.2 | v72.1,35.01 71.75,35.37 71.75,38.75 71.05,39.45 71.05,59.53 IC4.8
  Bottom 0.152: v34.67,29.06 35.28,29.67 35.91,29.67 36.48,29.1 38.99,29.1 39.25,29.35 67.8,29.35 69.07,28.08 70.4,28.08 73.49,31.17 73.49,33.66 72.13,35.01 v72.1,35.01
DOUT1  (via drill 0.3)
  Top 0.152: v72.13,34.1 71.72,34.1 71.39,34.43 71.39,38.59 70.69,39.29 70.69,59.18 IC4.9 | v38.73,29.73 37.97,28.98 IC3.2
  Bottom 0.152: v38.73,29.73 38.75,29.7 67.95,29.7 69.22,28.43 70.25,28.43 73.13,31.32 73.13,33.1 v72.13,34.1
DOUT2  (via drill 0.3)
  Top 0.152: v72.11,33.19 71.03,34.27 71.03,38.44 70.32,39.15 70.32,58.84 IC4.10 | v37.14,30.39 36.7,29.95 IC3.3
  Bottom 0.152: v72.11,33.19 72.78,32.52 72.78,31.48 70.08,28.79 69.37,28.79 68.08,30.09 39.35,30.09 39.03,30.4 37.15,30.4 v37.14,30.39
ENC_A  (via drill 0.3)
  Top 0.152: R5.1 C5.2 104.61,16.71 105.44,17.54 105.44,25.92 103.11,28.25 98.94,28.25 94.3,32.88 v94.3,33.06 | IC4.119 88.25,38.09 89.04,38.09 89.11,38.02 89.11,34.07 v88.19,33.16
  Power 0.152: v94.3,33.06 88.3,33.06 v88.19,33.16
ENC_B  (via drill 0.3)
  Top 0.152: C6.1 R10.1 111.05,17.7 110.11,18.64 106.92,18.64 106.19,19.38 106.19,26.2 103.43,28.96 99.24,28.96 96.19,32 v96.19,32.59 | IC4.120 88.6,38.44 89.2,38.44 89.49,38.15 89.49,33.39 v88.33,32.23
  Power 0.152: v88.33,32.23 88.8,32.7 93.65,32.7 93.93,32.42 96.03,32.42 v96.19,32.59
ENC_SW  (via drill 0.3)
  Top 0.152: IC4.173 75.19,60.53 75.19,56.46 v76.98,54.67 | v99.43,48.07 98.3,49.2 v98.3,54.03 | v99.42,42.9 97.15,40.63 97.15,33.91 v97.57,33.49 | v95.27,33.06 95.27,32.42 99.09,28.6 103.28,28.6 105.82,26.06 105.82,15.63 106.66,14.8 C2.2 107.12,14.22 110,11.34 SW1.E
  Bottom 0.152: v76.98,54.67 v76.98,54.66 77.32,54.32 86.3,54.32 87.29,55.31 90.48,55.31 91.47,54.32 96.78,54.32 97.07,54.03 v98.3,54.03 | v97.57,33.49 95.7,33.49 v95.27,33.06 | v99.42,42.9 99.42,48.06 v99.43,48.07
EOUT_A
  Top 0.152: SW1.A 112.5,12.08 111.05,13.53 R10.2 R9.2
EOUT_B
  Top 0.152: R1.2 R5.2 102.54,14.79 102.54,13.34 103.81,12.06 106.73,12.06 107.5,11.3 SW1.B
ETH_COL  (via drill 0.3)
  Top 0.254: RN2.2 29.02,34 v29.04,34.02 | v52.06,40.84 52.06,41.69 54.54,44.17 56.32,44.17 56.86,43.62 57.58,43.62 IC4.47
  Power 0.254: v35.26,38.47 34.69,38.47 30.24,34.02 v29.04,34.02
  Bottom 0.254: v35.26,38.47 41.14,38.47 41.95,39.28 45.6,39.28 46.47,40.16 51.38,40.16 v52.06,40.84
ETH_CRS  (via drill 0.3)
  Top 0.203: v20.73,29.15 20.63,29.15 JP5.1
  Top 0.254: IC4.40 58.32,49.63 57.65,49.63 v57.51,49.49 | RN1.4 25.22,32.44 v25.32,32.35
  Bottom 0.254: v57.51,49.49 54.96,46.94 51.8,46.94 51.27,47.46 41.75,47.46 40.55,46.27 29.68,46.27 28.29,44.87 28.29,40.01 25.32,37.03 v25.32,32.35 22.11,29.15 v20.73,29.15
ETH_MDC  (via drill 0.3)
  Top 0.203: IC17.31 15.58,36.22
  Top 0.254: v19.26,39.29 18.66,39.29 15.58,36.22 | IC4.33 60.55,52.35 v60.55,52.69
  Bottom 0.254: v60.55,52.69 60.46,52.6 50.26,52.6 49.61,53.25 31.25,53.25 20.1,42.1 19.97,41.97 19.26,41.26 v19.26,39.29
ETH_MDIO  (via drill 0.3)
  Top 0.203: R43.1 13.77,35.11 IC17.30
  Top 0.254: IC4.42 58.6,47.93 58.6,47.48 57.94,46.83 57.92,46.83 57.9,46.81 57.22,46.81 56.61,47.42 53.71,47.42 v53.33,47.8 | v19.99,40.44 19.09,40.44 IC17.30
  Bottom 0.254: v19.99,40.44 26.31,46.75 40.34,46.75 41.53,47.94 51.45,47.94 51.87,48.36 52.48,48.36 53.04,47.8 v53.33,47.8
ETH_RX_CLK  (via drill 0.3)
  Top 0.254: IC4.41 59.6,47.64 v59.64,47.64 | RN1.2 24.85,30.84 25.16,31.15 32.22,31.15 v32.45,30.92
  Power 0.254: v36.4,40.18 36.4,36.78 32.45,32.83 v32.45,30.92
  Bottom 0.254: v59.64,47.64 58.46,46.46 51.59,46.46 51.07,46.98 46.21,46.98 39.41,40.18 v36.4,40.18
ETH_RX_DV  (via drill 0.3)
  Top 0.254: IC4.53 57.26,39.06 55.07,39.06 v54.22,38.23 | RN1.3 34.34,31.64 v34.51,31.47
  Power 0.254: v54.22,38.23 54.13,38.32 50.51,38.32 43.67,31.47 v34.51,31.47
ETH_RX_ER  (via drill 0.3)
  Top 0.203: JP8.1 JP6.1
  Top 0.254: RN2.1 v27.14,33.2 | JP8.1 25.05,28.38 v25.15,28.49
  Bottom 0.254: v27.14,33.2 27.14,30.48 v25.15,28.49
ETH_RXD0  (via drill 0.3)
  Top 0.254: RN2.3 27.02,34.8 27.32,35.1 34.02,35.1 34.55,35.64 v34.55,36.69 | IC4.54 57.48,38.58 56.04,38.58 v54.84,37.39
  Bottom 0.254: v34.55,36.69 34.57,36.66 54.12,36.66 v54.84,37.39
ETH_RXD1  (via drill 0.3)
  Top 0.254: RN2.4 33.42,35.6 v33.82,36.01 | IC4.55 60.92,41.34 57.67,38.1 56.57,38.1 v55.86,37.39
  Bottom 0.254: v55.86,37.39 54.65,36.18 35.04,36.18 34.8,35.94 33.89,35.94 v33.82,36.01
ETH_RXD2  (via drill 0.3)
  Top 0.254: RN3.1 29.18,38.48 30.03,37.63 30.46,37.63 v30.47,37.62 | IC4.83 71.43,32.02 71.43,32.54 v71.36,32.6
  Bottom 0.254: v30.47,37.62 30.7,37.39 30.7,36.21 32.49,34.42 64.52,34.42 65.98,32.96 70.29,32.96 70.64,32.6 v71.36,32.6
ETH_RXD3  (via drill 0.3)
  Top 0.254: RN3.2 29.09,39.27 29.7,38.67 v30,38.67 | IC4.84 72.03,31.91 v72.14,31.91
  Bottom 0.152: v72.14,31.91 72.09,31.86
  Bottom 0.254: v30,38.67 29.76,38.43 29.76,36.46 32.29,33.93 64.34,33.93 65.79,32.49 70.1,32.49 70.72,31.86 72.09,31.86
ETH_TX_CLK  (via drill 0.3)
  Top 0.254: IC4.35 61.38,50.1 v61.79,50.1 | v27.35,40.07 RN3.3 | v28.53,49.53 28.53,46.13 v28.45,46.05
  Bottom 0.254: v61.79,50.1 59.77,52.12 50.05,52.12 49.41,52.77 31.45,52.77 28.53,49.85 v28.53,49.53 | v27.35,40.07 27.77,40.49 27.77,45.36 v28.45,46.05
ETH_TX_EN  (via drill 0.3)
  Top 0.254: RN3.4 28.19,40.88 29.48,39.59 v30.79,39.59 | v70.79,33.41 70.7,33.41 IC4.80
  Bottom 0.254: v30.79,39.59 30.79,38.32 31.18,37.92 31.18,36.41 32.69,34.9 64.74,34.9 66.22,33.41 v70.79,33.41
ETH_TXD0  (via drill 0.3)
  Top 0.254: RN4.1 27.85,42.18 28.58,41.45 29.48,41.45 v29.49,41.47 | IC4.85 70.95,30.12 70.49,30.12 v70.29,30.33
  Bottom 0.254: v29.49,41.47 29.27,41.24 29.27,36.26 32.07,33.45 59.1,33.45 61.17,31.38 69.63,31.38 70.29,30.72 v70.29,30.33
ETH_TXD1  (via drill 0.3)
  Top 0.254: RN4.2 28.37,42.98 v29.01,42.34 | IC4.86 71.16,29.63 70.01,29.63 v69.82,29.44
  Bottom 0.254: v29.01,42.34 28.78,42.11 28.78,36.04 31.86,32.97 58.89,32.97 60.96,30.9 68.01,30.9 69.47,29.44 v69.82,29.44
ETH_TXD2  (via drill 0.3)
  Top 0.254: RN4.3 27.1,43.78 27.28,43.97 27.28,51.1 v27.5,51.32 | IC4.34 59.62,52.57 v59.62,53.3
  Bottom 0.254: v59.62,53.3 59.4,53.09 50.46,53.09 49.32,54.23 30.41,54.23 v27.5,51.32
ETH_TXD3  (via drill 0.3)
  Top 0.254: v29.81,54.66 26.8,51.65 26.8,44.82 RN4.4 | v77.51,58.33 77.51,58.61 IC4.167
  Bottom 0.254: v29.81,54.66 30.42,55.27 49.2,55.27 51.36,57.43 60.15,57.43 60.22,57.37 60.23,57.37 60.35,57.24 66.96,57.24 68.08,58.36 77.49,58.36 v77.51,58.33
FMC_A0
  Top 0.254: IC8.23 43.49,54.89 41.47,56.91 41.47,59.6 48.26,66.4 60.75,66.4 64.98,62.17 64.98,59.94 IC4.16
FMC_A1
  Top 0.254: IC4.17 64.5,59.72 64.5,61.96 60.55,65.91 48.47,65.91 41.97,59.41 41.97,57.1 43.38,55.69 IC8.24
FMC_A2
  Top 0.254: IC4.18 64.01,59.49 64.01,61.76 60.34,65.43 48.67,65.43 42.46,59.22 42.46,57.29 43.26,56.49 IC8.25
FMC_A3
  Top 0.254: IC4.19 63.53,59.27 63.53,61.56 60.14,64.95 48.87,64.95 42.94,59.02 42.94,57.68 43.34,57.29 IC8.26
FMC_A4  (via drill 0.3)
  Top 0.254: IC4.20 63.58,58.51 v63.21,58.51 | IC8.29 38.14,57.29 v38.16,57.28
  Bottom 0.254: v63.21,58.51 63.06,58.66 62.13,58.66 61.92,58.45 51.01,58.45 49.52,56.96 39.25,56.96 38.93,57.28 v38.16,57.28
FMC_A5  (via drill 0.3)
  Top 0.254: IC4.21 63.59,57.8 62.65,57.8 v62.42,57.95 | IC8.30 38.71,56.49 v38.73,56.48
  Bottom 0.254: v62.42,57.95 51.2,57.95 49.73,56.48 v38.73,56.48
FMC_A6
  Top 0.254: IC8.31 35.62,55.69 42.03,49.28 42.03,37.81 43.16,36.68 43.98,36.68 45.27,36.68 57.48,36.68 58.78,37.97 61.12,37.97 IC4.60
FMC_A7
  Top 0.254: IC4.63 62.42,37.16 62.42,36.46 62.16,36.2 42.96,36.2 41.53,37.62 41.53,49.09 35.73,54.89 IC8.32
FMC_A8
  Top 0.254: IC4.64 62.92,36.95 62.92,36.28 62.35,35.71 42.75,35.71 42.7,35.76 42.6,35.87 41.05,37.41 41.05,48.87 35.84,54.08 33.11,54.08 IC8.33
FMC_A9
  Top 0.254: IC4.65 63.41,36.73 63.41,36.09 62.55,35.23 42.55,35.23 42.5,35.28 42.17,35.61 40.57,37.21 40.57,48.65 35.93,53.29 IC8.34
FMC_A10  (via drill 0.3)
  Top 0.254: IC4.66 63.9,36.51 63.9,35.89 62.76,34.75 42.33,34.75 40.06,37.02 40.06,48.13 v39.67,48.53 | v42.87,51.65 42.87,53.48 43.48,54.09 IC8.22
  Bottom 0.254: v39.67,48.53 40,48.53 42.87,51.4 v42.87,51.65
FMC_A11
  Top 0.254: IC4.67 64.38,36.29 64.38,35.69 62.96,34.27 42.12,34.27 42.08,34.3 41.51,34.87 39.58,36.8 39.58,47.61 38.95,48.23 38.95,49.58 36.05,52.49 IC8.35
FMC_BA0  (via drill 0.3)
  Top 0.254: IC8.20 45.1,52.49 47.54,54.93 v53.42,54.93 | IC4.112 78.83,42.55 78.83,45.97 v78.38,46.43
  Bottom 0.254: v53.42,54.93 53.89,54.93 55.25,53.57 58.88,53.57 59.33,54.01 62.25,54.01 65.73,50.53 74.6,50.53 78.38,46.76 v78.38,46.43
FMC_BA1  (via drill 0.3)
  Top 0.254: IC8.21 44.17,53.35 45.25,53.35 47.31,55.41 52.57,55.41 v52.8,55.64 | IC4.113 79.29,42.8 v79.29,46.49
  Bottom 0.254: v52.8,55.64 53.87,55.64 55.45,54.05 58.68,54.05 59.12,54.5 62.42,54.5 62.96,53.96 62.96,53.95 65.89,51.02 74.77,51.02 v79.29,46.49
FMC_D0  (via drill 0.3)
  Top 0.254: IC8.2 v43.02,38.09 | IC4.97 77.39,33.39 77.39,37.62 v77.06,37.95
  Bottom 0.254: v43.02,38.09 50.05,38.09 50.92,38.95 63.33,38.95 63.82,38.46 70.39,38.46 70.9,37.95 v77.06,37.95
FMC_D1  (via drill 0.3)
  Top 0.254: IC8.4 48.82,39.69 v49.23,39.28 | IC4.98 77.84,33.64 77.84,38.14 77.12,38.86 v77.06,38.86
  Bottom 0.254: v77.06,38.86 76.94,38.86 76.5,38.42 71.09,38.42 70.56,38.94 64.03,38.94 63.53,39.43 49.38,39.43 v49.23,39.28
FMC_D2  (via drill 0.3)
  Top 0.152: v80.69,44.11
  Top 0.254: IC8.5 45.23,40.49 v45.23,40.45 | v80.69,44.11 IC4.142
  Bottom 0.254: v45.23,40.45 46.08,40.45 46.27,40.64 50.84,40.64 51.76,41.55 55.45,41.55 56.21,40.79 64.97,40.79 65.88,41.71 78.29,41.71 v80.69,44.11
FMC_D3  (via drill 0.3)
  Top 0.254: IC8.7 44.96,42.09 v45.84,41.21 | IC4.143 80.89,45.02 v80.62,45.02
  Bottom 0.254: v45.84,41.21 45.93,41.12 50.64,41.12 51.55,42.04 55.66,42.04 56.42,41.27 64.8,41.27 65.7,42.18 78.1,42.18 80,44.08 80,44.4 v80.62,45.02
FMC_D4  (via drill 0.3)
  Top 0.254: IC8.8 44.86,42.89 45.84,41.91 46.54,41.91 v46.6,41.85 | IC4.68 66.07,37.27 66.07,43.04 65.37,43.74 v65.37,43.87
  Bottom 0.254: v46.6,41.85 48.84,41.85 50.59,43.6 65.1,43.6 v65.37,43.87
FMC_D5  (via drill 0.3)
  Top 0.254: IC8.10 45.24,44.49 45.65,44.9 v46.03,44.9 | IC4.69 66.55,37.04 66.55,43.26 66.08,43.73 66.08,44.49 v65.84,44.73
  Bottom 0.254: v65.84,44.73 65.1,44.73 64.46,44.08 50.38,44.08 49.27,42.96 47.96,42.96 v46.03,44.9
FMC_D6  (via drill 0.3)
  Top 0.254: IC8.11 45.28,45.29 45.65,45.66 46.74,45.66 v46.79,45.61 | IC4.70 67.05,36.83 67.05,43.46 66.56,43.94 66.56,45.31 v66.34,45.54
  Bottom 0.254: v66.34,45.54 65.23,45.54 64.25,44.56 47.76,44.56 46.79,45.53 v46.79,45.61
FMC_D7  (via drill 0.3)
  Top 0.254: IC8.13 44.94,46.89 45.5,46.33 47.08,46.33 47.72,45.7 v47.72,45.62 | IC4.73 68.32,35.98 68.32,36.65 67.53,37.44 67.53,43.67 67.05,44.16 v67.05,46.3
  Bottom 0.254: v67.05,46.3 65.3,46.3 64.04,45.05 48.29,45.05 v47.72,45.62
FMC_D8
  Top 0.254: IC8.42 36.68,46.89 39.09,44.48 39.09,36.6 41.91,33.78 61.09,33.78 62.44,32.44 63.66,32.44 65.37,34.15 67.19,34.15 IC4.74
FMC_D9
  Top 0.254: IC8.44 36.23,45.29 38.61,42.9 38.61,36.39 41.7,33.3 60.89,33.3 62.23,31.95 63.86,31.95 65.57,33.67 67.42,33.67 IC4.75
FMC_D10
  Top 0.254: IC8.45 35.95,44.49 38.13,42.3 38.13,36.2 41.51,32.82 60.69,32.82 62.03,31.47 64.06,31.47 65.78,33.19 67.64,33.19 IC4.76
FMC_D11
  Top 0.254: IC8.47 36.12,42.89 37.65,41.36 37.65,35.99 41.3,32.33 60.48,32.33 61.83,30.99 64.27,30.99 65.98,32.7 67.87,32.7 IC4.77
FMC_D12
  Top 0.254: IC8.48 35.73,42.09 37.16,40.65 37.16,35.79 41.1,31.85 60.27,31.85 61.62,30.49 64.46,30.49 66.18,32.22 68.09,32.22 IC4.78
FMC_D13
  Top 0.254: IC8.50 34.97,40.49 36.68,38.77 36.68,35.59 39.02,33.25 39.02,31.89 40.1,30.81 59.92,30.81 61.22,29.52 63.1,29.52 65.41,27.2 74.15,27.2 75.95,29.01 75.95,29.17 IC4.89
FMC_D14
  Top 0.254: IC8.51 35.07,39.69 36.2,38.56 36.2,35.37 38.52,33.05 38.52,31.69 39.88,30.33 59.72,30.33 61.02,29.03 62.9,29.03 65.21,26.72 74.34,26.72 76.56,28.94 76.56,29.27 IC4.90
FMC_D15
  Top 0.254: IC8.53 34.59,38.09 35.72,36.96 35.72,35.15 38.04,32.83 38.04,31.47 39.68,29.83 59.53,29.83 60.81,28.55 62.69,28.55 65,26.24 74.54,26.24 77.06,28.75 77.06,29.48 IC4.91
FMC_NBL0  (via drill 0.3, 0.3 pad 0.3)
  Top 0.254: IC4.169 77.18,59.69 76.36,59.69 v75.89,59.22 | IC8.15 43.23,48.49 43.08,48.64 43.08,49.71 39.62,53.17 39.62,58.57 v39.41,58.78
  Bottom 0.254: v39.41,58.78 39.41,58.8 40.53,59.92 75.07,59.92 75.77,59.22 v75.89,59.22
FMC_NBL1  (via drill 0.3)
  Top 0.254: IC4.170 76.95,60.17 v75.82,60.17 | IC8.39 32.01,49.29 31.78,49.52 v31.78,56.41
  Bottom 0.254: v31.78,56.41 35.26,56.41 39.27,60.43 75.57,60.43 v75.82,60.17
FMC_SDCKE0  (via drill 0.3)
  Top 0.254: IC4.43 56.81,49.02 53.55,49.02 v53.27,48.74 | v35.11,50.89 IC8.37
  Bottom 0.254: v53.27,48.74 53.27,49.19 52.56,49.9 42.05,49.9 39.98,47.83 38.17,47.83 v35.11,50.89
FMC_SDCLK  (via drill 0.3)
  Top 0.203: IC8.38 34.2,50.09 v34.22,50.1
  Top 0.254: IC4.116 83.94,40.27 v82.85,40.27
  Power 0.254: v34.22,50.1 40.59,43.73 46.63,43.73 50.6,39.75 52.77,39.75 v53.17,40.15
  Bottom 0.203: v53.17,40.15 53.29,39.99 55.62,39.99 55.96,40.34 77.02,40.34 77.35,40.01 82.61,40.01 82.85,40.25 v82.85,40.27
FMC_SDNCAS  (via drill 0.3)
  Top 0.254: IC8.17 43.4,50.09 40.11,53.38 40.11,59.79 41.63,61.32 v41.63,61.58 | IC4.160 81.08,57.25 v80.23,56.4
  Bottom 0.254: v41.63,61.58 42.31,60.91 76.86,60.91 80.23,57.54 v80.23,56.4
FMC_SDNE0  (via drill 0.3)
  Top 0.254: IC8.19 45.51,51.69 v45.9,51.3 46.3,51.69 R25.2 | IC4.44 56.86,48.26 54.22,48.26 v54.17,48.31
  Bottom 0.254: v54.17,48.31 54.17,48.97 52.76,50.38 46.82,50.38 v45.9,51.3
FMC_SDNRAS  (via drill 0.3)
  Top 0.254: IC8.18 45.12,50.89 45.43,50.57 48.87,50.57 49.71,49.73 49.71,47.5 50.77,46.44 v50.77,46.27 | IC4.59 63.5,41.07 63.5,42.74 62.56,43.67 v62.56,46.2
  Bottom 0.254: v50.77,46.27 51.06,45.97 62.34,45.97 v62.56,46.2
FMC_SDNWE
  Top 0.254: IC4.46 58.55,45.31 58.55,45.52 58.16,45.91 51.39,45.91 51.06,45.58 50.42,45.58 50.04,45.96 50.04,46.48 49.23,47.3 49.23,49.53 48.68,50.08 45.74,50.08 44.95,49.29 IC8.16
FRM2
  cutout Gnd: 51.34,3.2 49.05,3.2 49.05,8.53 51.34,8.53
  cutout Top: 51.34,3.2 49.05,3.2 49.05,8.53 51.34,8.53
FRM3
  cutout Power: 51.34,3.2 49.05,3.2 49.05,8.53 51.34,8.53
GND  (via drill 0.3, 0.4)
  Top 0.152: v93.97,12.5 94.74,12.5 C47.- | v93.67,9.2 IC10.2 | LCD1.6 52.91,16.43 v52.7,16.64 52.41,16.35 LCD1.5 | LCD1.13 56.41,16.41 v56.63,16.64 56.91,16.36 LCD1.14 | LCD1.21 60.41,16.41 v60.63,16.64 60.91,16.36 LCD1.22 | v113.02,13.84 C6.2 | C5.1 v104.49,13.86 | v107.12,17.65 C2.1 | C3.1 v127.37,6.35 | C35.2 v92.78,58.59 | v34.09,58.24 33.08,58.11 IC8.28 | v70.12,17.64 IC14.3 | v91.89,24.92 IC15.14 | IC15.17 91.86,22.99 v91.88,22.97 | C58.2 v88.98,25.55 | v99.1,22.33 IC15.3 | C57.2 88.02,18.43 v88.03,18.41 | IC15.7 96.3,24.92 v96.28,24.91 | v86.54,57.85 86.4,57.71 C27.2 | v93.44,55.66 93.44,56.09 IC6.3 | v100.19,46.38 99.99,46.58 C19.- | C56.1 98.24,35.38 v98.19,35.33 | C51.2 101.92,31.45 v101.98,31.51 | v104.79,34.56 104.84,34.62 IC13.TP | v67.57,18.78 67.57,22.02 JP4.NO | C7.1 40.96,23.71 v40.95,23.72 | v108.88,57.05 R23.2 R24.2 | IC16.3
  Top 0.203: C65.2 v8.54,44.46 | C68.2 v8.56,42.38 | C67.2 v8.56,40.66 | C66.- 6.86,38.7 v6.85,38.68 | R59.1 8.58,36.73 v8.55,36.7 | v21.21,45.66 21.21,46.36 C62.2 | v11.51,45.62 11.62,46.37 C60.2 | IC17.19 14.75,41.53 | v21.33,38.51 IC17.47 | v27.77,37.1 26.89,37.09 C70.2 | v24.48,26.06 23.54,25.64 R46.1 | v86.56,34.86 86.47,35.93 C20.2 | IC4.117 84.81,40.1 v84.81,40.82 | R49.1 v16.69,25.65 | R22.2 99.37,55.93 v99.38,55.87
  Top 0.229: C49.1 84.74,19.13 v84.74,18.29
  Top 0.254: IC1.3 30.46,20.11 v30.54,20.07 | v25.14,24.07 IC2.2 | ZD1.A 40.58,15.61 v40.9,15.48 | C36.2 v101.43,58.64 | v102.12,55.72 102.12,56.12 IC7.3 | v42.92,41.27 44.09,41.27 IC8.6 | IC8.46 32,43.69 v31.93,43.62 | IC8.54 33.08,37.27 31.95,37.27 v31.95,37.27 | v31.93,38.86 33.07,38.86 IC8.52 | IC8.12 44.05,46.04 43.34,46.04 v42.84,45.54 | LCD1.29 64.41,14.44 v64.38,14.41 | C55.1 v74.21,20.54 | IC4.61 63.72,39.87 64.15,39.87 v64.37,39.65 | C17.2 v58.95,37.11 | v59.71,56.67 58.79,56.67 C8.1 | v52.94,56.67 53.9,56.67 C9.1 | C32.2 51.58,52.35 C31.2 51.31,53.77 v51.29,53.8 | v56.94,51.41 56.7,52.16 C15.2 | IC4.37 60.89,49.18 v60.89,49.15 | IC9.4 v107.34,43.83 | C69.2 v16.45,30.63 | IC17.35 16.55,34.32 17.39,35.17 v17.73,35.17 17.73,34.83 IC17.36 | v28.15,57.61 30.01,57.99 D1.A | v15.17,63.56 15.18,62.97 C11.2 | v12.16,55.03 12.16,53.98 IC5.1 | C12.- 17.92,56.13 v17.62,56.44 | v20.1,22.61 C59.2 | v24.08,21.2 23.16,21.2 C61.1 | C63.1 10.16,21.59 v10.15,22.05 | v15.18,44.37 15.18,43.95 IC17.15 | v17.73,29.73 17.73,30.58 C64.2 | 14.75,41.53 15.49,40.79 v15.49,40.01 | v61.51,55.23 61.51,55.93 C14.2 | v65.85,61.85 66.4,61.86 C13.2 | v88.08,34.25 C21.2 | C25.2 v94.8,44.2 | v95.37,42.33 C33.2 | v88.95,47.37 88.95,47.42 IC4.135 | v94.33,49.66 C26.2 | C37.2 61.7,7.94 v61.36,8.28 | IC12.3 v80.06,16.71 v80.05,16.71 | C1.2 30.22,23.18 v30.15,23.11 | v40.96,18.09 40.09,18.09 ZD2.A | LCD1.3 51.41,14.56 v51.62,14.35 | IC8.41 34.04,47.69 v34.45,48.09 | JP1.NC 79.57,65.19 C28.2 76.61,64.08 v76.61,63.44 | C54.1 v98.02,15.95 | C53.1 v96.18,16.55 | v67.81,27.93 68.01,28.15 C23.2 | v65.7,27.91 65.73,28.53 C34.2 | v54.11,40.68 54.11,41.39 R12.1 | v66.28,54.76 65.91,54.76 IC4.22
  Top 0.254: v67.61,36.36 67.28,36.36 IC4.71 | v55.3,40.69 56.01,40.69 C16.2 | IC4.14 68.61,57.73 68.61,57.23 v68.43,57.05 | v81.26,37.69 81.57,37.69 IC4.109 | v70.31,64.11 70.31,64.38 C22.2 | IC4.103 79.75,35.27 79.75,35.62 v79.92,35.8 | v88.36,3.52 Q1.E | IC15.4 IC15.3 IC15.2 | v90.43,20.47 90.43,21.02 IC15.20 | TOUCH.C 102.71,23.16 v102.72,23.15 | C10.2 11.1,67.12 v11.19,67.03 | IC4.148 84.33,51.99 83.95,51.99 v82.75,50.79 | IC4.95 78.49,30.87 v78.66,30.87 | C24.2 82.01,31.03 v82.72,31.03 | v89.28,45.31 89.28,44.83 IC4.130 | v63.02,33.12 C18.2 | v53.99,20.45 52.92,20.13 C48.2 | C46.2 50.52,20.75 v50.18,21.09 | v52.39,22.31 R30.2 | IC4.158 80.99,55.73 v80.99,55.69 | v110.61,47.94 111.33,47.68 C38.1 | IC16.3 v14.96,20.6
  Top 0.356: IC11.2 48.01,24.12
  Top 0.406: v36.71,22.66 IC3.6 | C4.2 v33.52,24.89 | C39.2 v47.74,37.38 | v48.75,43.67 C40.2 | v47.72,48.68 C41.2 | C42.2 v48.57,58.1 | C43.2 v30.74,48.74 | v30.75,44.26 C44.2 | C29.2 89.44,53.81 89.4,53.85 v89.39,54.59 89.4,55.15 C30.2 | IC13.7 109.87,35.33 v109.89,35.32 | C50.1 109.54,31.06 v109.22,30.75 | 48.01,24.12 v47.98,24.14 | v43.83,27.5 43.83,26.76 C45.2
  Bottom 0.254: J1.6 v64.45,2.95 v64.46,2.96 | J1.S 55.2,3.89 v55.25,3.94
  other vias: 93.97,11.73 43.03,27.5 90.07,54.58 100.19,47.08 59.44,14.41 40.96,18.78 40.9,16.18 105.66,35.45 105.66,34.56 104.79,35.45 109.92,30.75 28.15,58.31 9.75,67.03 12.86,55.03 11.46,55.03 17.62,55.74 62.06,8.28 49.86,41.85 72.39,41.02 72.41,42.86 72.74,39.32 86.21,46.57 86.22,44.55 50.87,21.09
  pour Gnd (isolate 0.203): 0.05,69.85 139.31,69.85 139.31,0.25 48.19,-0.13 48.19,11.18 39.65,11.2 39.65,7.39 36.88,7.39 36.88,11.18 28.12,11.18 28.12,-0.13 0.05,-0.13
  pour Bottom (isolate 0.203, rank 2): 0.44,70.36 139.12,70.36 139.12,-0.25 48.19,-0.25 48.19,11.18 39.68,11.18 39.68,7.37 36.88,7.37 36.88,11.18 28.12,11.18 28.12,-0.25 0.44,-0.25
HOLE_MCU1  (via drill 3.2 pad 5.5)
  other vias: 3,66.5
HOLE_MCU2  (via drill 3.2 pad 5.5)
  other vias: 122,66.5
HOLE_MCU3  (via drill 3.2 pad 5.5)
  other vias: 3,3.5
HOLE_MCU4  (via drill 3.2 pad 5.5)
  other vias: 122,3.5
I2C1_SCL  (via drill 0.3)
  Top 0.152: X2.13 36.17,62.63 36.17,64.59 39.36,67.78 80.24,67.78 81.54,66.48 82.15,66.48 82.44,66.78 v83.68,66.78 | IC15.11 91.55,26.87 93.81,29.13 95.33,29.13 95.74,29.54 v96.47,29.54 | IC4.164 81.5,60.48 82.06,60.48 82.78,61.2 v83.84,61.2 83.84,62.16 R15.2 | IC9.5 v114.84,44.31 v114.85,44.32 115.24,43.93 115.24,33.02 v114.43,32.21 | v114.85,45.61 115.24,46 115.24,52.83 113.89,54.19 113.89,55.05 | X1.28 124.95,51.76 121.85,54.86 115.08,54.86 v114.99,54.95 | v113.89,59.04 113.89,55.05 | v113.71,54.97 113.8,54.97 113.89,55.05
  Bottom 0.152: v83.68,66.78 83.84,66.62 v83.84,61.2 83.84,61.05 84.07,60.82 88.9,60.82 89.95,59.78 112.75,59.78 113.49,59.04 v113.89,59.04 | v114.85,45.61 v114.85,44.32 | v96.47,29.54 113.42,29.54 114.43,30.56 v114.43,32.21 | v113.71,54.97 114.98,54.97 v114.99,54.95
I2C1_SDA  (via drill 0.3)
  Top 0.152: X2.14 34.87,63.83 39.2,68.16 80.38,68.16 81.42,67.12 v81.86,67.12 | IC15.13 91.44,25.58 92.12,26.25 92.12,26.92 93.96,28.77 v95.88,28.77 | IC4.165 81.47,61.15 v81.82,61.15 81.82,61.5 81.86,61.54 | IC9.6 115.62,44.96 | v115.14,31.57 115.14,32.41 115.62,32.89 115.62,44.96 | 115.62,44.96 115.62,53.02 114.36,54.29 114.36,55.63 | 114.36,55.63 114.36,58.22 v114.62,58.48 | 114.36,55.63 115.24,55.63 115.62,55.24 121.97,55.24 122.92,54.3 X1.30
  Top 0.203: R16.2 81.86,61.54
  Bottom 0.152: v81.86,67.12 81.82,67.08 v81.82,61.15 81.82,61.04 82.42,60.44 88.74,60.44 89.78,59.4 112.63,59.4 113.62,58.41 114.55,58.41 v114.62,58.48 | v95.88,28.77 96.61,28.77 97.02,29.17 113.56,29.17 115.14,30.76 v115.14,31.57
IRQ_TOUCH  (via drill 0.3)
  Top 0.152: IC4.151 81.03,50.81 v81.03,50.79 | v93.6,26.24 IC15.9
  Bottom 0.152: v81.03,50.79 81.83,50.79 82.48,50.14 83.1,50.14 83.82,50.86 85.96,50.86 87.91,48.91 87.91,44.35 93.21,39.05 93.21,26.63 v93.6,26.24
LCD_DISP
  Top 0.152: R35.1 65.54,24.19 65.54,16.71 65.41,16.58 LCD1.31
LED_ACT  (via drill 0.3)
  Top 0.203: IC17.26 13.33,37.5 10.98,35.14 9.22,35.14 v7.9,33.82 7.9,32.76 R47.2 | R55.2 v7.89,29.4 v7.9,29.41
  Bottom 0.203: v7.9,29.41 v7.9,33.82
LED_LINK  (via drill 0.3)
  Top 0.203: IC17.28 11.4,34.15 v11.4,33.71 11.4,33.13 R54.2 | v5.91,24.96 R56.2
  Bottom 0.203: v5.91,24.96 5.95,24.96 8.89,27.9 8.89,31.15 11.4,33.66 v11.4,33.71
LED_SPEED  (via drill 0.3 pad 0.2)
  Top 0.152: 9.81,33.27 9.83,33.3
  Top 0.203: R52.2 9.81,33.27 | IC17.27 10.22,33.68 v9.83,33.68 | SPEED.C 5.94,33.78 v5.91,33.81
  Top 0.254: 9.83,33.3 v9.83,33.68
  Bottom 0.203: v9.83,33.68 8.8,34.71 6.81,34.71 v5.91,33.81
LTDC_B2  (via drill 0.3)
  Top 0.152: v75.95,33.31 75.68,33.58 75.68,45.48 78.96,48.76 79.92,48.76 81.67,50.49 81.67,50.74 IC4.150 | LCD1.23 61.41,18.86 v60.62,19.65
  Bottom 0.152: v75.95,33.31 76.84,32.42 76.84,26.99 74.95,25.09 74.12,25.09 71.39,22.36 67.84,22.36 67.59,22.12 64.83,19.36 60.91,19.36 v60.62,19.65
LTDC_B3  (via drill 0.3)
  Top 0.152: v75.19,32.26 74.92,32.52 74.92,46.83 IC4.154 | LCD1.24 61.91,20.18 v61.74,20.34
  Bottom 0.152: v75.19,32.26 75.19,31.89 76.13,30.95 76.13,27.3 74.64,25.82 73.82,25.82 71.07,23.08 67.53,23.08 64.8,20.34 v61.74,20.34
LTDC_B4  (via drill 0.3)
  Top 0.152: v74.79,31.36 74.54,31.61 74.54,47.15 IC4.155 | LCD1.25 62.41,21 v62.23,21.17
  Bottom 0.152: v62.23,21.17 62.27,21.13 65.08,21.13 67.38,23.43 70.92,23.43 73.66,26.18 74.49,26.18 75.77,27.46 75.77,30.38 v74.79,31.36
LTDC_B5  (via drill 0.3)
  Top 0.152: v74.48,30.44 74.16,30.76 74.16,47.3 75.42,48.55 75.42,55.7 74.3,56.82 74.3,60.35 IC4.174 | LCD1.26 62.91,21.81 v62.72,22
  Bottom 0.152: v74.48,30.44 75.42,29.5 75.42,27.61 74.34,26.53 73.51,26.53 70.77,23.79 67.22,23.79 65.31,21.87 62.84,21.87 v62.72,22
LTDC_B6  (via drill 0.3)